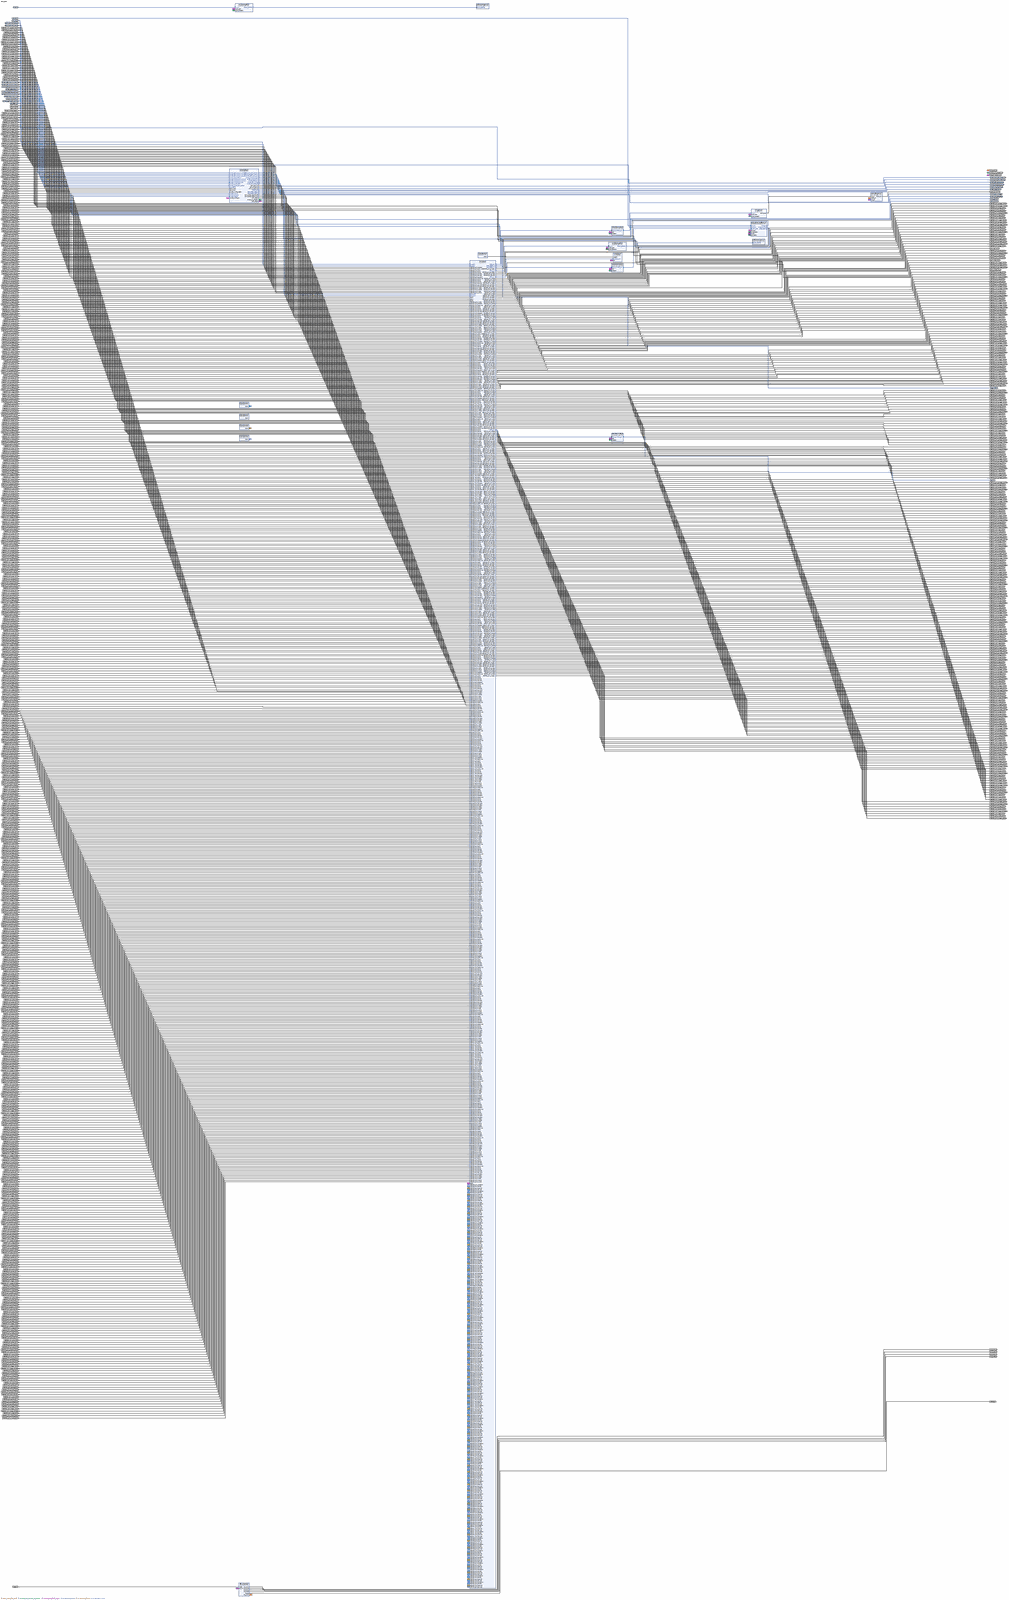
[diagram p0: block diagram of the top level, whole]
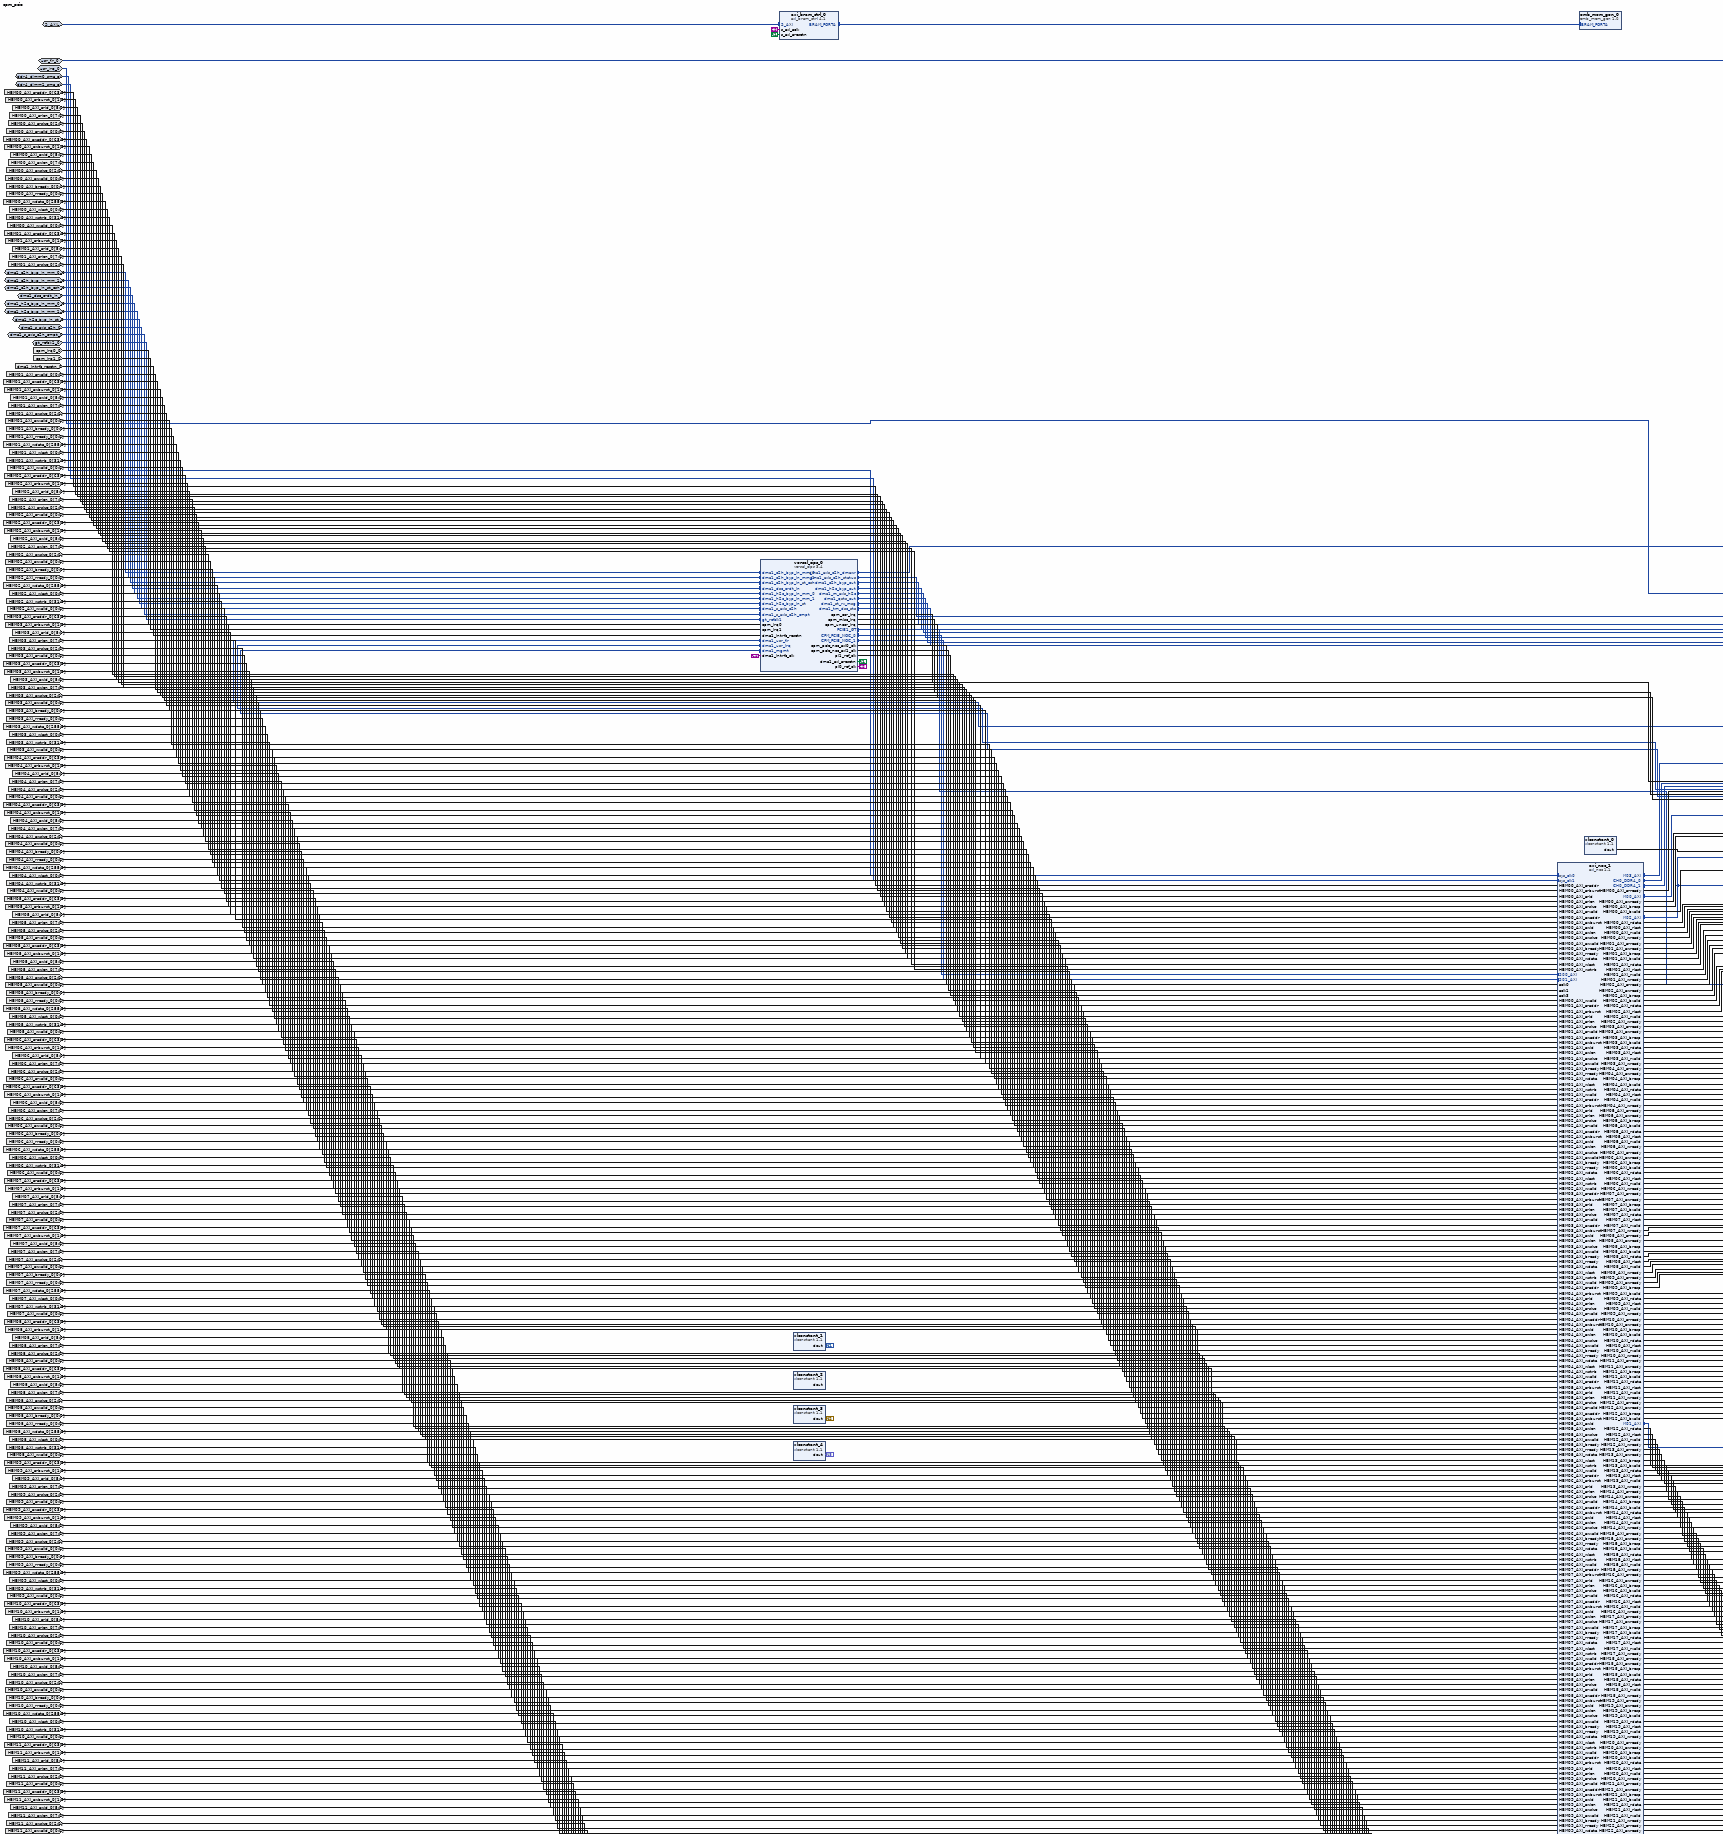
[diagram p1: block diagram of the top level, upper left part]
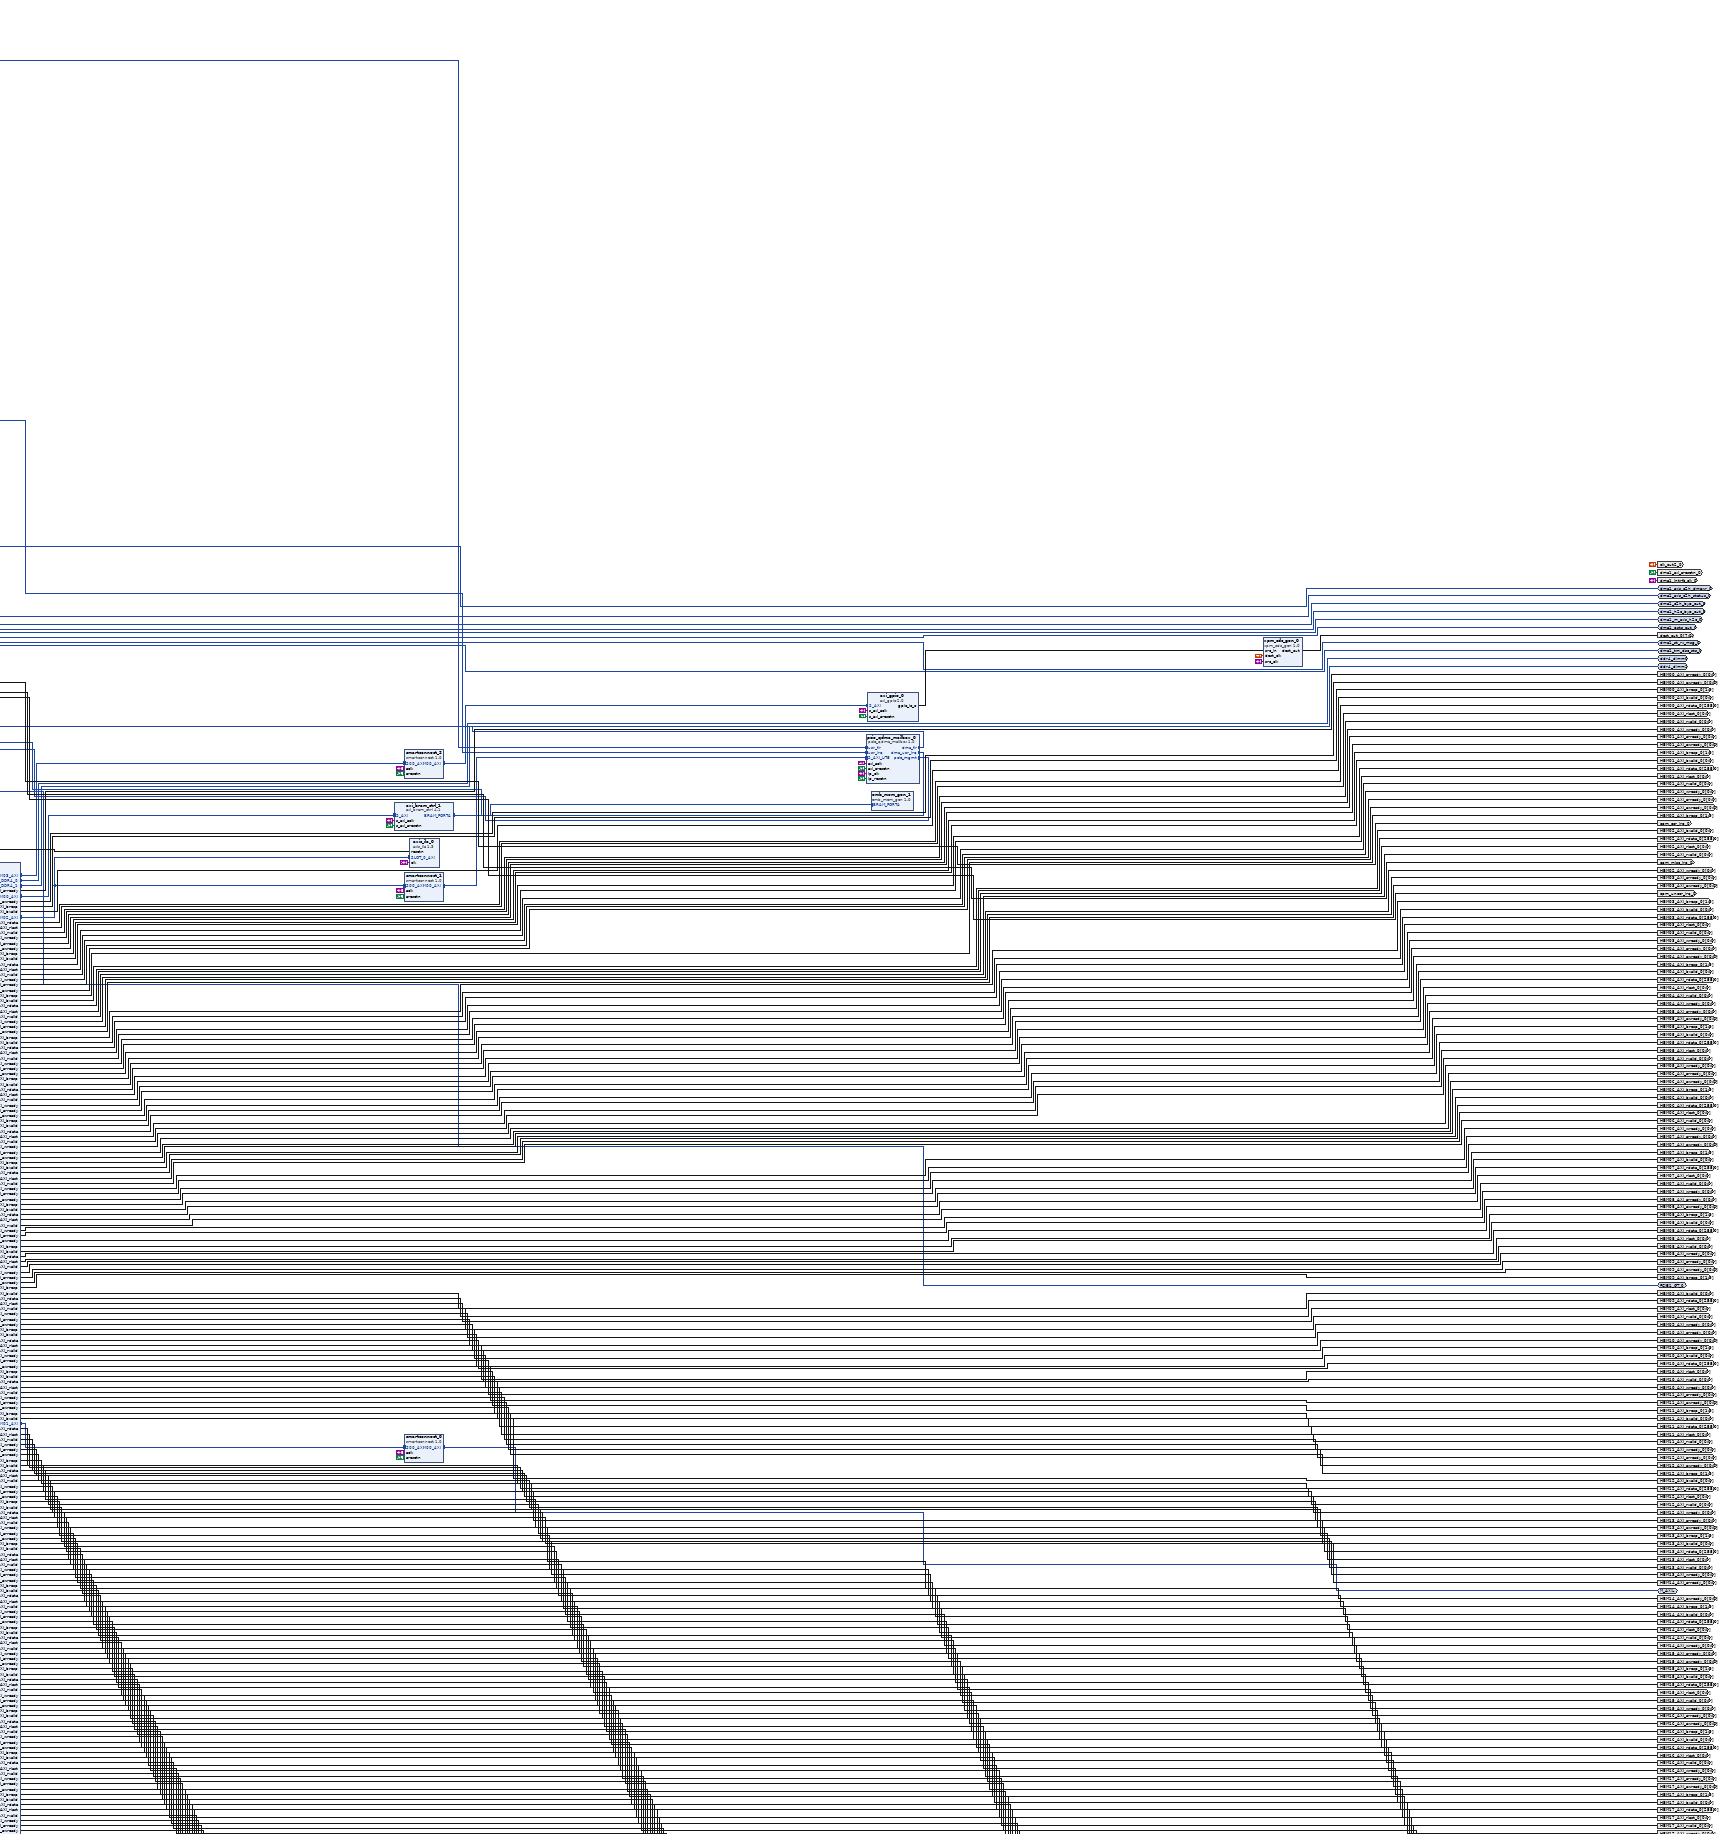
[diagram p2: block diagram of the top level, upper right part]
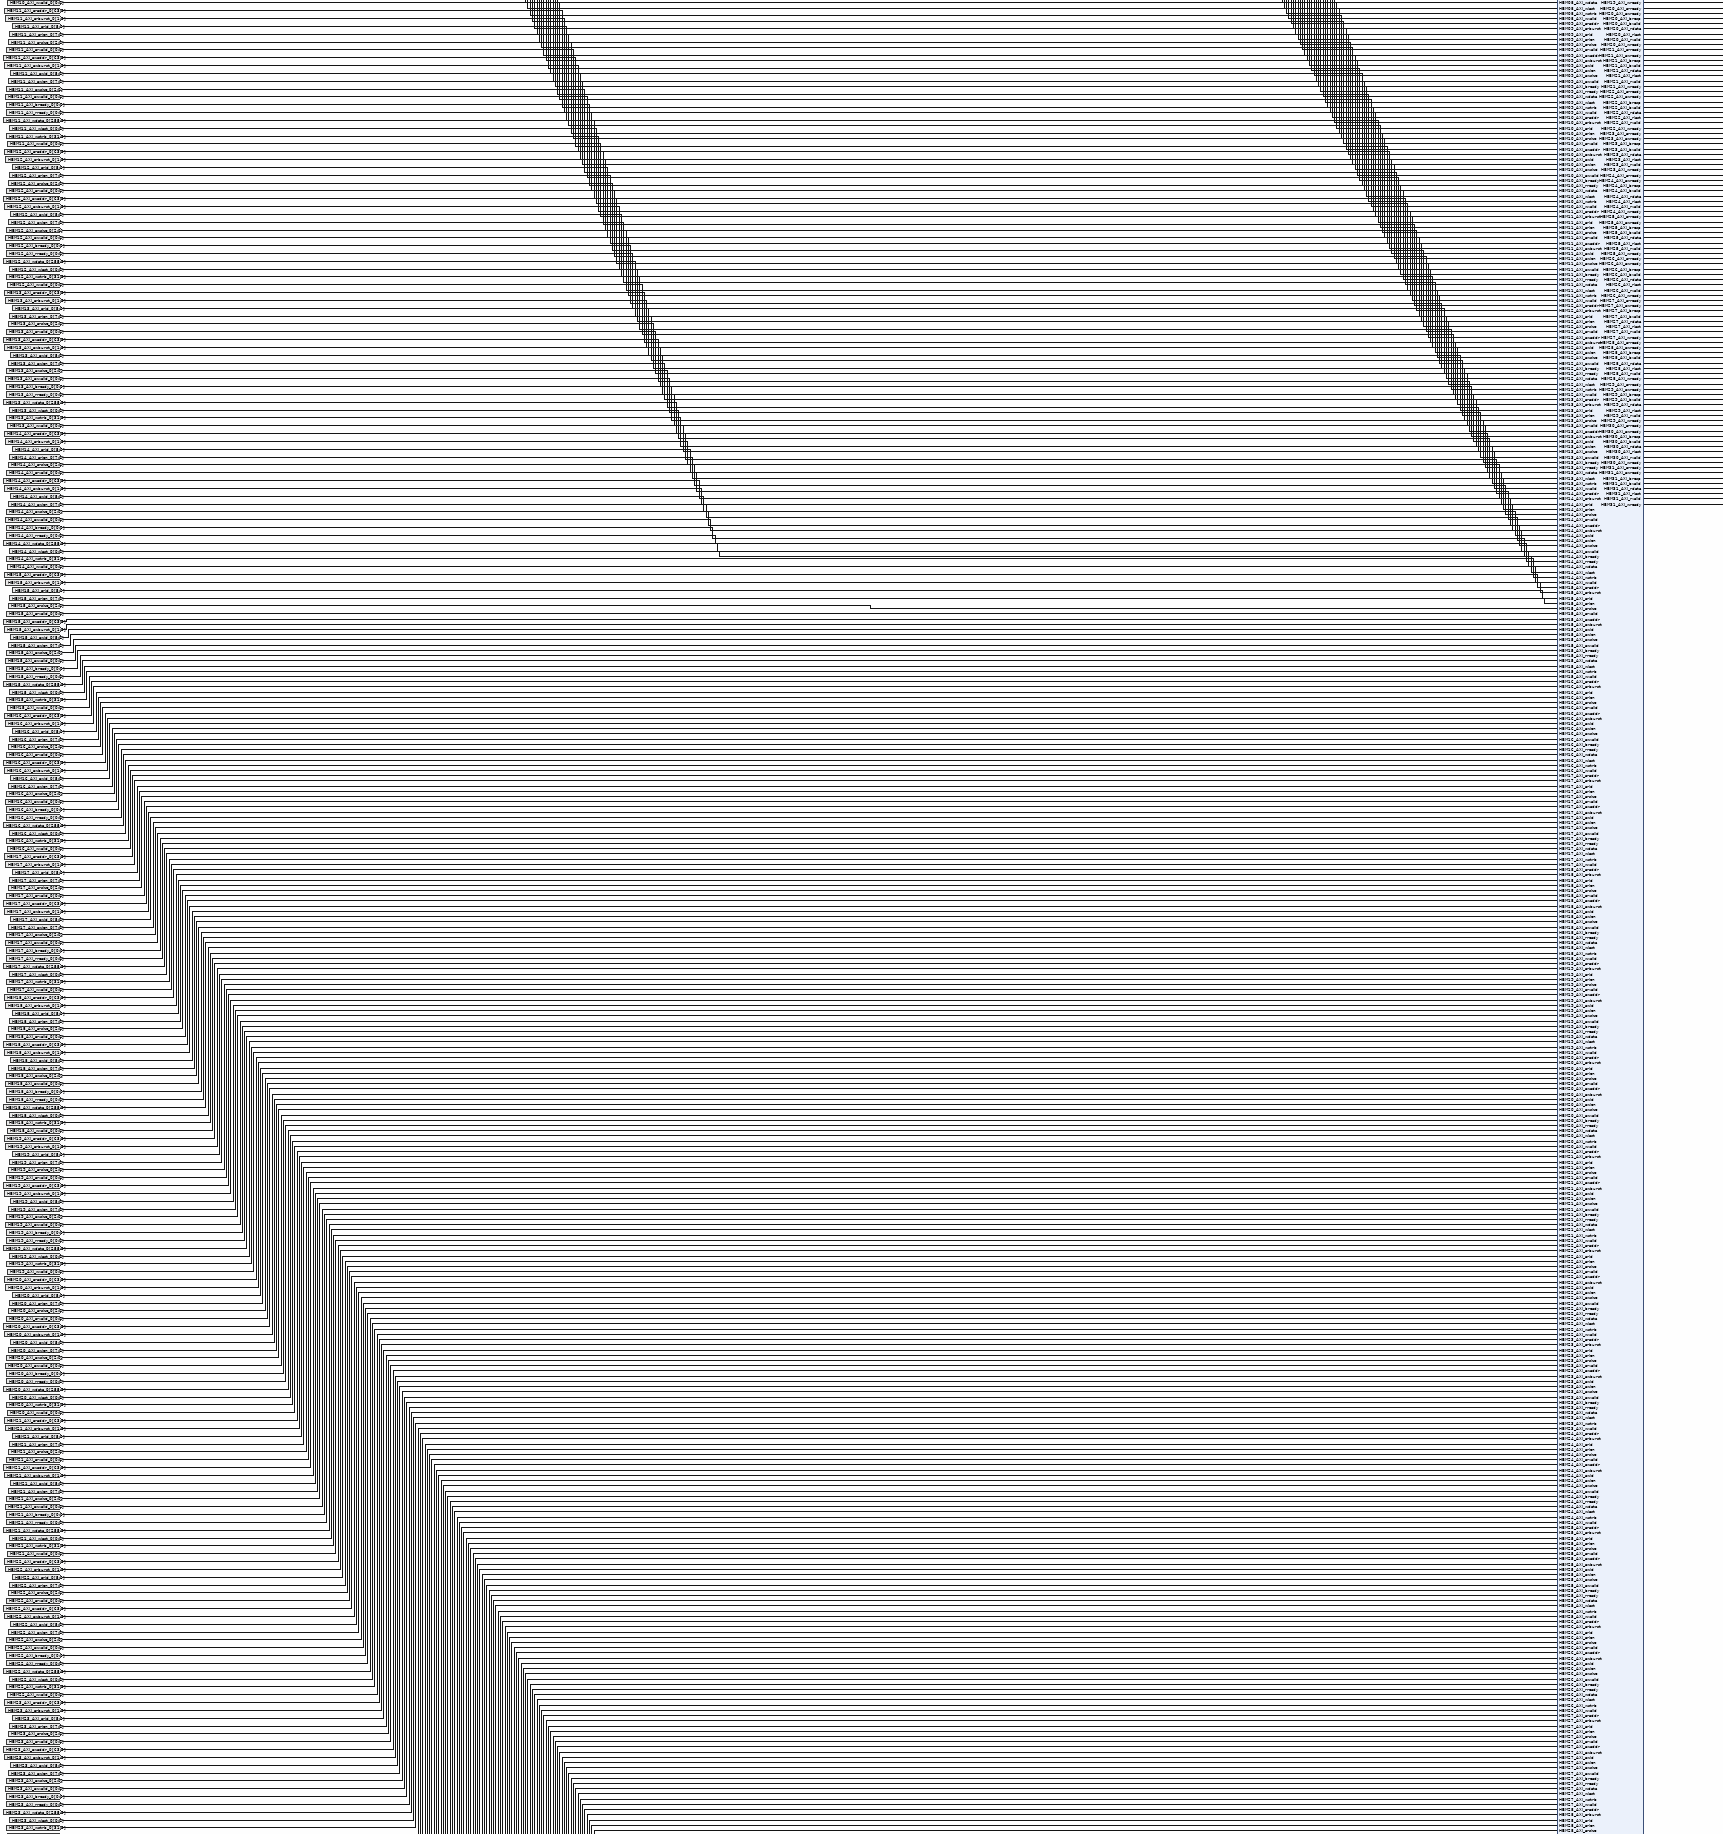
[diagram p3: block diagram of the top level, middle left part]
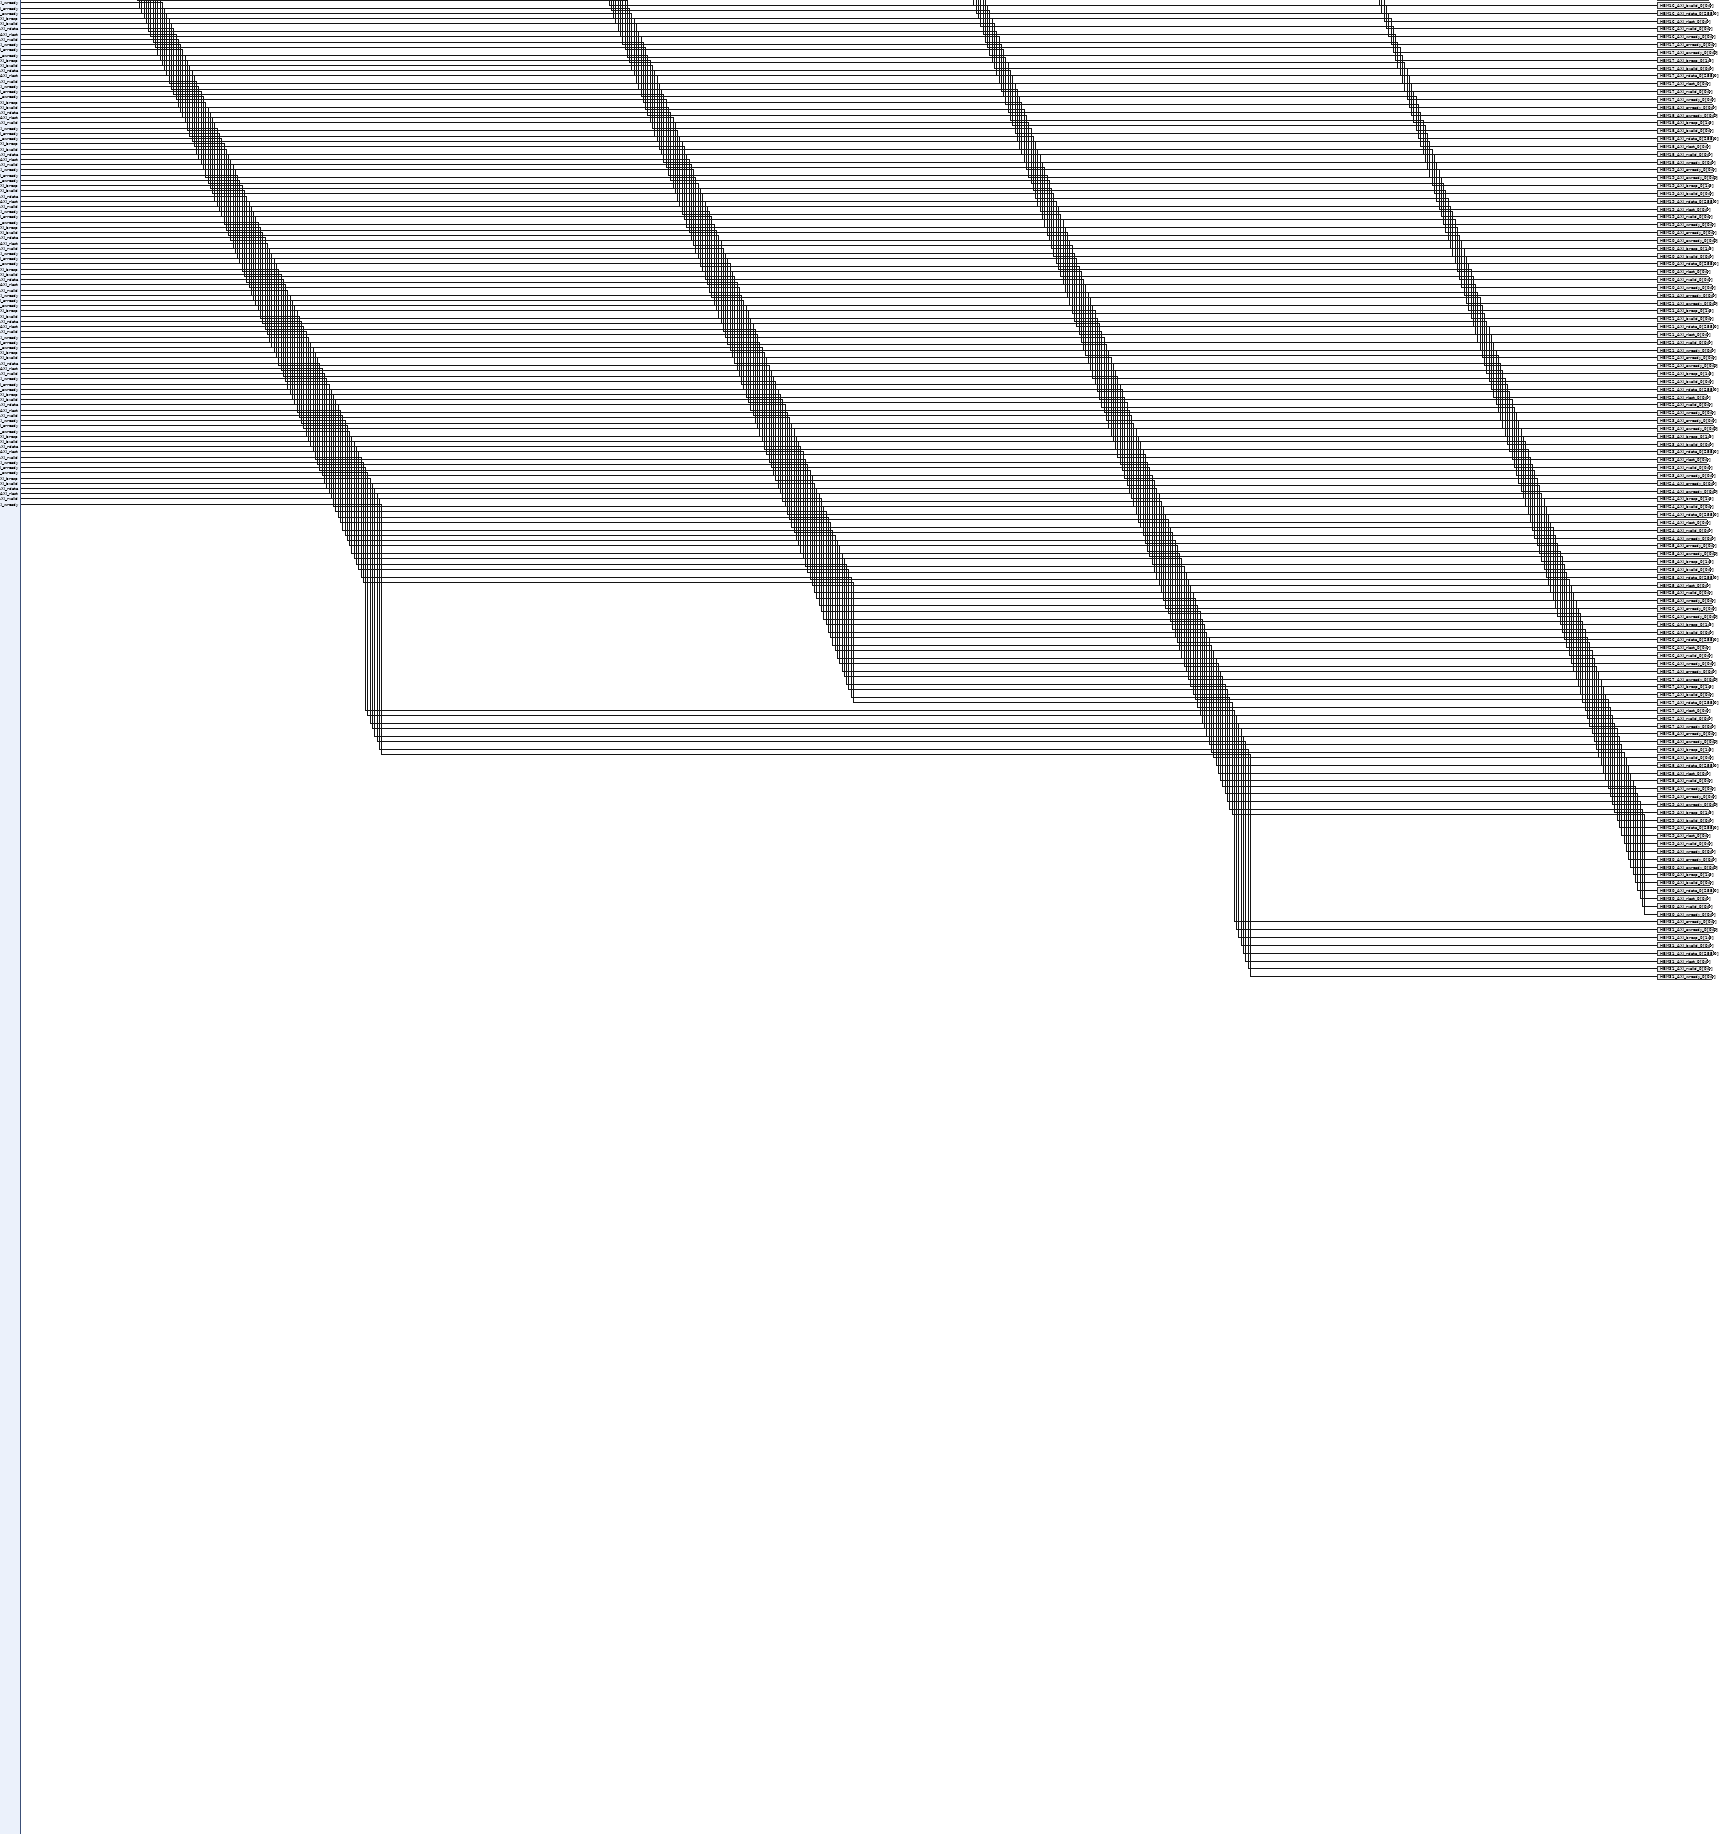
[diagram p4: block diagram of the top level, middle right part]
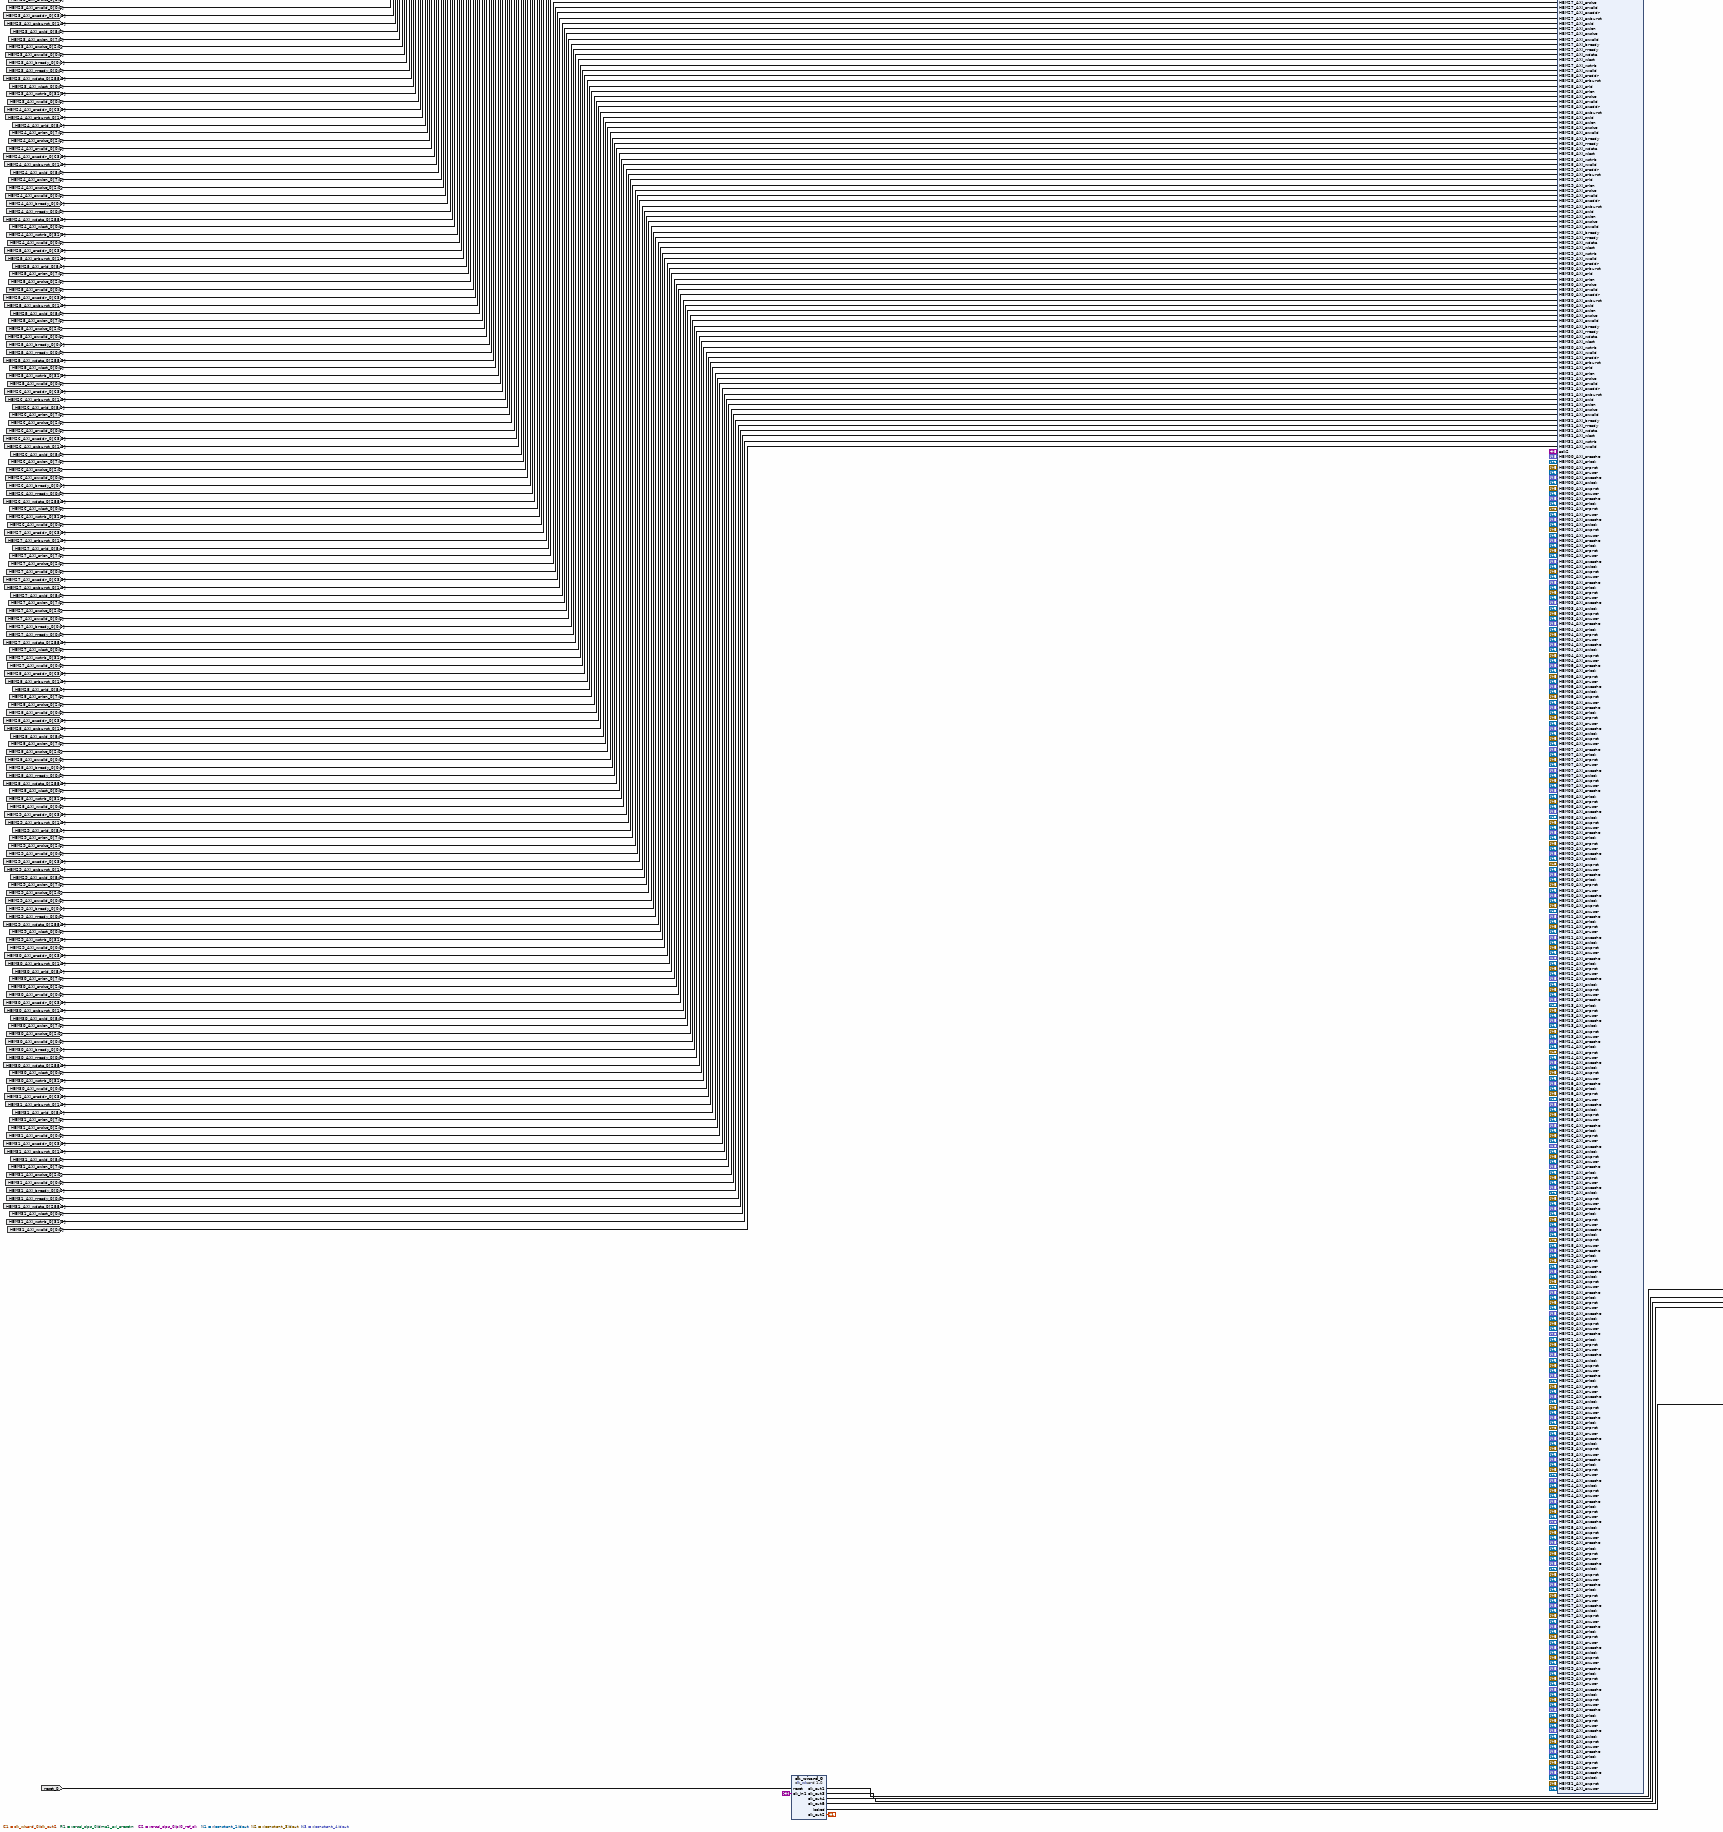
[diagram p5: block diagram of the top level, lower left part]
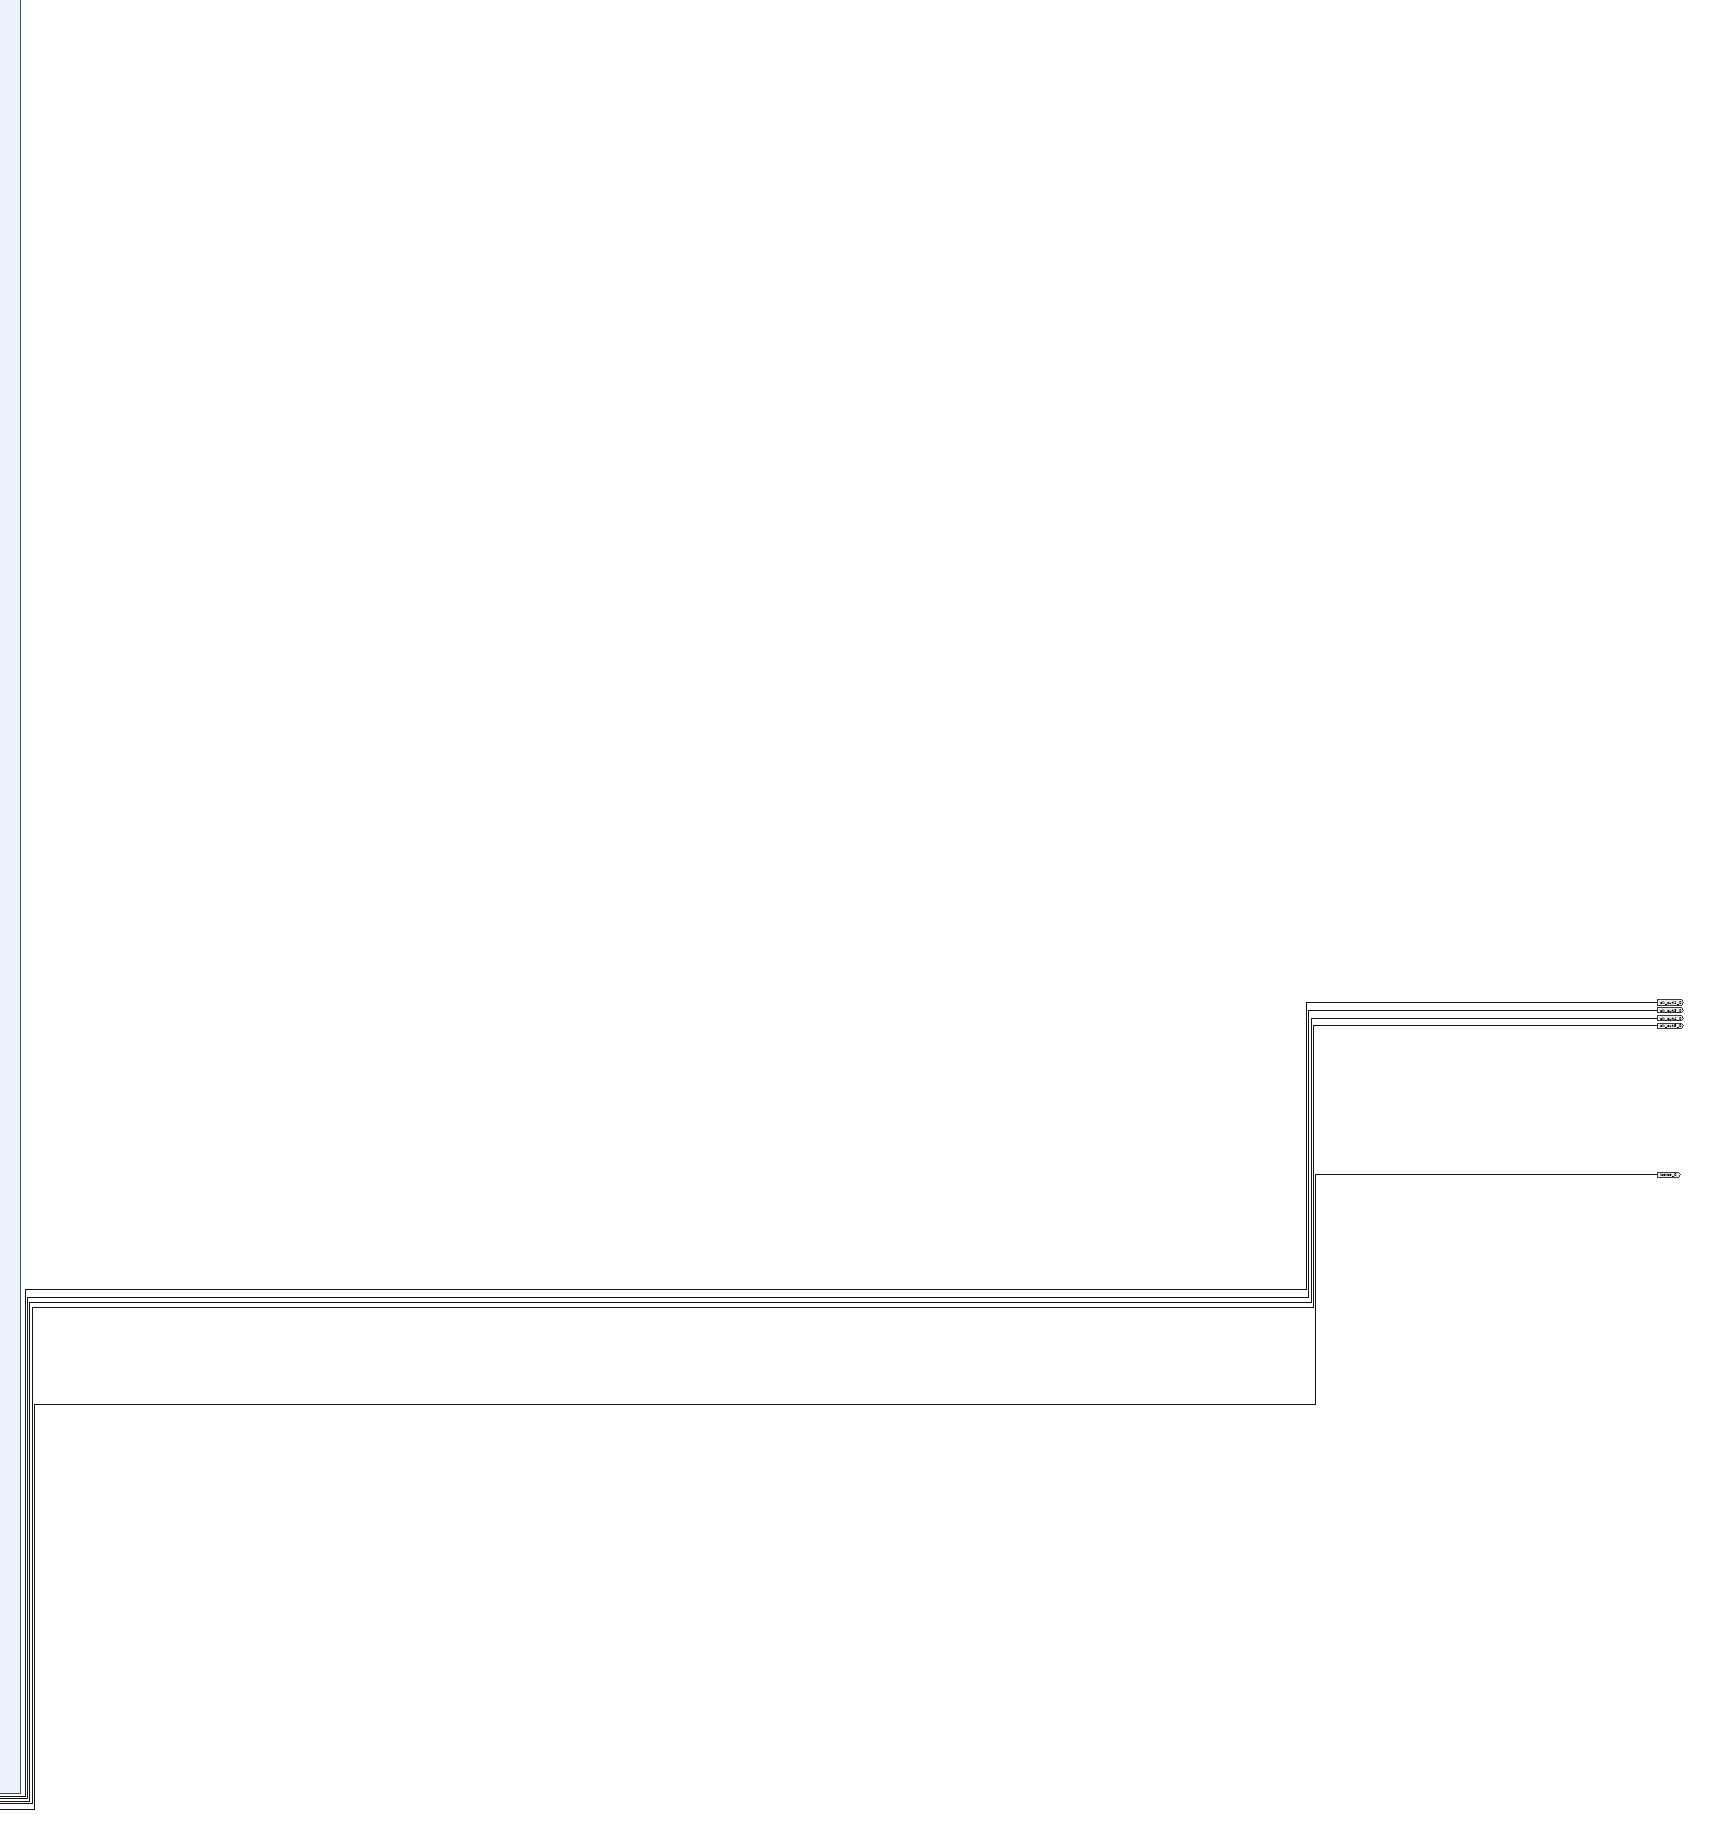
[diagram p6: block diagram of the top level, lower right part]
# Vivado block design cpm_pcie, xcvh1582-vsva3697-2MP-e-S, Vivado 2024.2
create_bd_design cpm_pcie

create_bd_intf_port -mode Slave -vlnv xilinx.com:display_eqdma:usr_flr_rtl:1.0 usr_flr_0
create_bd_intf_port -mode Slave -vlnv xilinx.com:interface:qdma_usr_irq_rtl:1.0 usr_irq_0
create_bd_intf_port -mode Slave -vlnv xilinx.com:interface:qdma_dsc_byp_rtl:1.0 dma1_c2h_byp_in_mm_0_0
create_bd_intf_port -mode Slave -vlnv xilinx.com:interface:qdma_dsc_byp_rtl:1.0 dma1_c2h_byp_in_mm_1_0
create_bd_intf_port -mode Slave -vlnv xilinx.com:interface:qdma_dsc_byp_rtl:1.0 dma1_h2c_byp_in_mm_0_0
create_bd_intf_port -mode Slave -vlnv xilinx.com:interface:qdma_dsc_byp_rtl:1.0 dma1_h2c_byp_in_mm_1_0
create_bd_intf_port -mode Slave -vlnv xilinx.com:interface:qdma_dsc_crdt_in_rtl:1.0 dma1_dsc_crdt_in_0
create_bd_intf_port -mode Slave -vlnv xilinx.com:interface:aximm_rtl:1.0 S_AXIL
set_property -dict [list \
  CONFIG.ADDR_WIDTH 15 \
  CONFIG.ARUSER_WIDTH 0 \
  CONFIG.AWUSER_WIDTH 0 \
  CONFIG.BUSER_WIDTH 0 \
  CONFIG.DATA_WIDTH 32 \
  CONFIG.HAS_BRESP 1 \
  CONFIG.HAS_BURST 0 \
  CONFIG.HAS_CACHE 0 \
  CONFIG.HAS_LOCK 0 \
  CONFIG.HAS_PROT 1 \
  CONFIG.HAS_QOS 0 \
  CONFIG.HAS_REGION 0 \
  CONFIG.HAS_RRESP 1 \
  CONFIG.HAS_WSTRB 1 \
  CONFIG.ID_WIDTH 0 \
  CONFIG.MAX_BURST_LENGTH 1 \
  CONFIG.NUM_READ_OUTSTANDING 1 \
  CONFIG.NUM_READ_THREADS 1 \
  CONFIG.NUM_WRITE_OUTSTANDING 1 \
  CONFIG.NUM_WRITE_THREADS 1 \
  CONFIG.PROTOCOL AXI4LITE \
  CONFIG.READ_WRITE_MODE READ_WRITE \
  CONFIG.RUSER_BITS_PER_BYTE 0 \
  CONFIG.RUSER_WIDTH 0 \
  CONFIG.SUPPORTS_NARROW_BURST 0 \
  CONFIG.WUSER_BITS_PER_BYTE 0 \
  CONFIG.WUSER_WIDTH 0 \
] [get_bd_intf_ports S_AXIL]
create_bd_intf_port -mode Master -vlnv xilinx.com:interface:aximm_rtl:1.0 M_AXIL
set_property -dict {CONFIG.ADDR_WIDTH 42 CONFIG.DATA_WIDTH 32 CONFIG.PROTOCOL AXI4} [get_bd_intf_ports M_AXIL]
create_bd_intf_port -mode Slave -vlnv xilinx.com:interface:diff_clock_rtl:1.0 gt_refclk1_0
create_bd_intf_port -mode Master -vlnv xilinx.com:interface:axis_rtl:1.0 dma1_st_rx_msg_0
create_bd_intf_port -mode Master -vlnv xilinx.com:interface:qdma_dsc_byp_rtl:1.0 dma1_c2h_byp_out_0
create_bd_intf_port -mode Master -vlnv xilinx.com:interface:qdma_dsc_byp_rtl:1.0 dma1_h2c_byp_out_0
create_bd_intf_port -mode Master -vlnv xilinx.com:interface:eqdma_qsts_rtl:1.0 dma1_qsts_out_0
create_bd_intf_port -mode Master -vlnv xilinx.com:interface:qdma_tm_dsc_sts_rtl:1.0 dma1_tm_dsc_sts_0
create_bd_intf_port -mode Master -vlnv xilinx.com:interface:gt_rtl:1.0 PCIE1_GT_0
create_bd_intf_port -mode Slave -vlnv xilinx.com:interface:qdma_dsc_byp_rtl:1.0 dma1_c2h_byp_in_st_csh_0
create_bd_intf_port -mode Slave -vlnv xilinx.com:interface:qdma_dsc_byp_rtl:1.0 dma1_h2c_byp_in_st_0
create_bd_intf_port -mode Slave -vlnv xilinx.com:display_eqdma:s_axis_c2h_rtl:1.0 dma1_s_axis_c2h_0
create_bd_intf_port -mode Slave -vlnv xilinx.com:display_eqdma:s_axis_c2h_cmpt_rtl:1.0 dma1_s_axis_c2h_cmpt_0
create_bd_intf_port -mode Master -vlnv xilinx.com:display_eqdma:axis_c2h_dmawr_rtl:1.0 dma1_axis_c2h_dmawr_0
create_bd_intf_port -mode Master -vlnv xilinx.com:display_eqdma:m_axis_h2c_rtl:1.0 dma1_m_axis_h2c_0
create_bd_intf_port -mode Master -vlnv xilinx.com:interface:qdma_c2h_status_rtl:1.0 dma1_axis_c2h_status_0
create_bd_intf_port -mode Master -vlnv xilinx.com:interface:ddr4_rtl:1.0 ddr4_dimm0
create_bd_intf_port -mode Master -vlnv xilinx.com:interface:ddr4_rtl:1.0 ddr4_dimm1
create_bd_intf_port -mode Slave -vlnv xilinx.com:interface:diff_clock_rtl:1.0 ddr4_dimm0_sma_clk
set_property -dict {CONFIG.FREQ_HZ 200000000} [get_bd_intf_ports ddr4_dimm0_sma_clk]
create_bd_intf_port -mode Slave -vlnv xilinx.com:interface:diff_clock_rtl:1.0 ddr4_dimm1_sma_clk
set_property -dict {CONFIG.FREQ_HZ 200000000} [get_bd_intf_ports ddr4_dimm1_sma_clk]
create_bd_port -dir I -type intr cpm_irq0_0
create_bd_port -dir I -type intr cpm_irq1_0
create_bd_port -dir I -type rst dma1_intrfc_resetn_0
create_bd_port -dir O -type intr cpm_misc_irq_0
create_bd_port -dir O -type intr cpm_cor_irq_0
create_bd_port -dir O -type intr cpm_uncor_irq_0
create_bd_port -dir O -type clk dma1_intrfc_clk_0
set_property -dict {CONFIG.ASSOCIATED_BUSIF S_AXIL:dma1_st_rx_msg_0:M_AXIL} [get_bd_ports dma1_intrfc_clk_0]
create_bd_port -dir O -type rst dma1_axi_aresetn_0
create_bd_port -dir O -from 7 -to 0 dest_out_0
create_bd_port -dir I -type rst reset_0
set_property -dict {CONFIG.POLARITY ACTIVE_HIGH} [get_bd_ports reset_0]
create_bd_port -dir O -type clk clk_out1_0
create_bd_port -dir O locked_0
create_bd_port -dir O -type clk clk_out4_0
create_bd_port -dir O -type clk clk_out3_0
create_bd_port -dir O -type clk clk_out2_0
create_bd_port -dir O -type clk clk_out5_0
create_bd_port -dir O -from 255 -to 0 HBM00_AXI_rdata_0
create_bd_port -dir I -from 255 -to 0 HBM00_AXI_wdata_0
create_bd_port -dir O -from 255 -to 0 HBM01_AXI_rdata_0
create_bd_port -dir I -from 255 -to 0 HBM01_AXI_wdata_0
create_bd_port -dir O -from 255 -to 0 HBM02_AXI_rdata_0
create_bd_port -dir I -from 255 -to 0 HBM02_AXI_wdata_0
create_bd_port -dir O -from 255 -to 0 HBM03_AXI_rdata_0
create_bd_port -dir I -from 255 -to 0 HBM03_AXI_wdata_0
create_bd_port -dir O -from 255 -to 0 HBM04_AXI_rdata_0
create_bd_port -dir I -from 255 -to 0 HBM04_AXI_wdata_0
create_bd_port -dir O -from 255 -to 0 HBM05_AXI_rdata_0
create_bd_port -dir I -from 255 -to 0 HBM05_AXI_wdata_0
create_bd_port -dir O -from 255 -to 0 HBM06_AXI_rdata_0
create_bd_port -dir I -from 255 -to 0 HBM06_AXI_wdata_0
create_bd_port -dir O -from 255 -to 0 HBM07_AXI_rdata_0
create_bd_port -dir I -from 255 -to 0 HBM07_AXI_wdata_0
create_bd_port -dir O -from 255 -to 0 HBM08_AXI_rdata_0
create_bd_port -dir I -from 255 -to 0 HBM08_AXI_wdata_0
create_bd_port -dir O -from 255 -to 0 HBM09_AXI_rdata_0
create_bd_port -dir I -from 255 -to 0 HBM09_AXI_wdata_0
create_bd_port -dir O -from 255 -to 0 HBM10_AXI_rdata_0
create_bd_port -dir I -from 255 -to 0 HBM10_AXI_wdata_0
create_bd_port -dir O -from 255 -to 0 HBM11_AXI_rdata_0
create_bd_port -dir I -from 255 -to 0 HBM11_AXI_wdata_0
create_bd_port -dir O -from 255 -to 0 HBM12_AXI_rdata_0
create_bd_port -dir I -from 255 -to 0 HBM12_AXI_wdata_0
create_bd_port -dir O -from 255 -to 0 HBM13_AXI_rdata_0
create_bd_port -dir I -from 255 -to 0 HBM13_AXI_wdata_0
create_bd_port -dir O -from 255 -to 0 HBM14_AXI_rdata_0
create_bd_port -dir I -from 255 -to 0 HBM14_AXI_wdata_0
create_bd_port -dir O -from 255 -to 0 HBM15_AXI_rdata_0
create_bd_port -dir I -from 255 -to 0 HBM15_AXI_wdata_0
create_bd_port -dir O -from 255 -to 0 HBM16_AXI_rdata_0
create_bd_port -dir I -from 255 -to 0 HBM16_AXI_wdata_0
create_bd_port -dir O -from 255 -to 0 HBM17_AXI_rdata_0
create_bd_port -dir I -from 255 -to 0 HBM17_AXI_wdata_0
create_bd_port -dir O -from 255 -to 0 HBM18_AXI_rdata_0
create_bd_port -dir I -from 255 -to 0 HBM18_AXI_wdata_0
create_bd_port -dir O -from 255 -to 0 HBM19_AXI_rdata_0
create_bd_port -dir I -from 255 -to 0 HBM19_AXI_wdata_0
create_bd_port -dir O -from 255 -to 0 HBM20_AXI_rdata_0
create_bd_port -dir I -from 255 -to 0 HBM20_AXI_wdata_0
create_bd_port -dir O -from 255 -to 0 HBM21_AXI_rdata_0
create_bd_port -dir I -from 255 -to 0 HBM21_AXI_wdata_0
create_bd_port -dir O -from 255 -to 0 HBM22_AXI_rdata_0
create_bd_port -dir I -from 255 -to 0 HBM22_AXI_wdata_0
create_bd_port -dir O -from 255 -to 0 HBM23_AXI_rdata_0
create_bd_port -dir I -from 255 -to 0 HBM23_AXI_wdata_0
create_bd_port -dir O -from 255 -to 0 HBM24_AXI_rdata_0
create_bd_port -dir I -from 255 -to 0 HBM24_AXI_wdata_0
create_bd_port -dir O -from 255 -to 0 HBM25_AXI_rdata_0
create_bd_port -dir I -from 255 -to 0 HBM25_AXI_wdata_0
create_bd_port -dir O -from 255 -to 0 HBM26_AXI_rdata_0
create_bd_port -dir I -from 255 -to 0 HBM26_AXI_wdata_0
create_bd_port -dir O -from 255 -to 0 HBM27_AXI_rdata_0
create_bd_port -dir I -from 255 -to 0 HBM27_AXI_wdata_0
create_bd_port -dir O -from 255 -to 0 HBM28_AXI_rdata_0
create_bd_port -dir I -from 255 -to 0 HBM28_AXI_wdata_0
create_bd_port -dir O -from 255 -to 0 HBM29_AXI_rdata_0
create_bd_port -dir I -from 255 -to 0 HBM29_AXI_wdata_0
create_bd_port -dir O -from 255 -to 0 HBM30_AXI_rdata_0
create_bd_port -dir I -from 255 -to 0 HBM30_AXI_wdata_0
create_bd_port -dir O -from 255 -to 0 HBM31_AXI_rdata_0
create_bd_port -dir I -from 255 -to 0 HBM31_AXI_wdata_0
create_bd_port -dir I -from 0 -to 0 HBM00_AXI_awvalid_0
create_bd_port -dir O -from 0 -to 0 HBM00_AXI_wready_0
create_bd_port -dir O -from 0 -to 0 HBM00_AXI_rvalid_0
create_bd_port -dir O -from 1 -to 0 HBM00_AXI_bresp_0
create_bd_port -dir I -from 1 -to 0 HBM00_AXI_awburst_0
create_bd_port -dir I -from 2 -to 0 HBM00_AXI_awsize_0
create_bd_port -dir O -from 0 -to 0 HBM00_AXI_rlast_0
create_bd_port -dir I -from 0 -to 0 HBM00_AXI_arvalid_0
create_bd_port -dir I -from 0 -to 0 HBM00_AXI_wlast_0
create_bd_port -dir I -from 2 -to 0 HBM00_AXI_arsize_0
create_bd_port -dir I -from 0 -to 0 HBM00_AXI_bready_0
create_bd_port -dir I -from 0 -to 0 HBM00_AXI_wvalid_0
create_bd_port -dir O -from 0 -to 0 HBM00_AXI_arready_0
create_bd_port -dir O -from 0 -to 0 HBM00_AXI_bvalid_0
create_bd_port -dir O -from 0 -to 0 HBM00_AXI_awready_0
create_bd_port -dir I -from 1 -to 0 HBM00_AXI_arburst_0
create_bd_port -dir I -from 0 -to 0 HBM00_AXI_rready_0
create_bd_port -dir I -from 1 -to 0 HBM01_AXI_awburst_0
create_bd_port -dir I -from 2 -to 0 HBM01_AXI_awsize_0
create_bd_port -dir I -from 0 -to 0 HBM01_AXI_wlast_0
create_bd_port -dir O -from 1 -to 0 HBM01_AXI_bresp_0
create_bd_port -dir O -from 0 -to 0 HBM01_AXI_awready_0
create_bd_port -dir I -from 0 -to 0 HBM01_AXI_bready_0
create_bd_port -dir I -from 0 -to 0 HBM01_AXI_awvalid_0
create_bd_port -dir O -from 0 -to 0 HBM01_AXI_bvalid_0
create_bd_port -dir I -from 0 -to 0 HBM01_AXI_arvalid_0
create_bd_port -dir I -from 0 -to 0 HBM01_AXI_wvalid_0
create_bd_port -dir O -from 0 -to 0 HBM01_AXI_rlast_0
create_bd_port -dir O -from 0 -to 0 HBM01_AXI_rvalid_0
create_bd_port -dir I -from 1 -to 0 HBM01_AXI_arburst_0
create_bd_port -dir O -from 0 -to 0 HBM01_AXI_wready_0
create_bd_port -dir I -from 2 -to 0 HBM01_AXI_arsize_0
create_bd_port -dir O -from 0 -to 0 HBM01_AXI_arready_0
create_bd_port -dir I -from 0 -to 0 HBM01_AXI_rready_0
create_bd_port -dir O -from 0 -to 0 HBM02_AXI_wready_0
create_bd_port -dir I -from 2 -to 0 HBM02_AXI_arsize_0
create_bd_port -dir I -from 1 -to 0 HBM02_AXI_awburst_0
create_bd_port -dir O -from 1 -to 0 HBM02_AXI_bresp_0
create_bd_port -dir I -from 0 -to 0 HBM02_AXI_wlast_0
create_bd_port -dir I -from 2 -to 0 HBM02_AXI_awsize_0
create_bd_port -dir I -from 1 -to 0 HBM02_AXI_arburst_0
create_bd_port -dir O -from 0 -to 0 HBM02_AXI_awready_0
create_bd_port -dir I -from 0 -to 0 HBM02_AXI_awvalid_0
create_bd_port -dir I -from 0 -to 0 HBM02_AXI_wvalid_0
create_bd_port -dir I -from 0 -to 0 HBM02_AXI_bready_0
create_bd_port -dir O -from 0 -to 0 HBM02_AXI_rlast_0
create_bd_port -dir O -from 0 -to 0 HBM02_AXI_bvalid_0
create_bd_port -dir I -from 0 -to 0 HBM02_AXI_arvalid_0
create_bd_port -dir O -from 0 -to 0 HBM02_AXI_rvalid_0
create_bd_port -dir O -from 0 -to 0 HBM02_AXI_arready_0
create_bd_port -dir I -from 0 -to 0 HBM02_AXI_rready_0
create_bd_port -dir O -from 0 -to 0 HBM03_AXI_rvalid_0
create_bd_port -dir I -from 2 -to 0 HBM03_AXI_awsize_0
create_bd_port -dir O -from 0 -to 0 HBM03_AXI_awready_0
create_bd_port -dir I -from 0 -to 0 HBM03_AXI_awvalid_0
create_bd_port -dir I -from 2 -to 0 HBM03_AXI_arsize_0
create_bd_port -dir O -from 1 -to 0 HBM03_AXI_bresp_0
create_bd_port -dir O -from 0 -to 0 HBM03_AXI_arready_0
create_bd_port -dir I -from 0 -to 0 HBM03_AXI_bready_0
create_bd_port -dir O -from 0 -to 0 HBM03_AXI_bvalid_0
create_bd_port -dir I -from 0 -to 0 HBM03_AXI_wvalid_0
create_bd_port -dir I -from 1 -to 0 HBM03_AXI_arburst_0
create_bd_port -dir O -from 0 -to 0 HBM03_AXI_wready_0
create_bd_port -dir I -from 0 -to 0 HBM03_AXI_wlast_0
create_bd_port -dir I -from 0 -to 0 HBM03_AXI_arvalid_0
create_bd_port -dir O -from 0 -to 0 HBM03_AXI_rlast_0
create_bd_port -dir I -from 1 -to 0 HBM03_AXI_awburst_0
create_bd_port -dir I -from 0 -to 0 HBM03_AXI_rready_0
create_bd_port -dir I -from 63 -to 0 HBM00_AXI_araddr_0
create_bd_port -dir I -from 5 -to 0 HBM00_AXI_arid_0
create_bd_port -dir I -from 7 -to 0 HBM00_AXI_arlen_0
create_bd_port -dir I -from 63 -to 0 HBM00_AXI_awaddr_0
create_bd_port -dir I -from 5 -to 0 HBM00_AXI_awid_0
create_bd_port -dir I -from 7 -to 0 HBM00_AXI_awlen_0
create_bd_port -dir I -from 31 -to 0 HBM00_AXI_wstrb_0
create_bd_port -dir I -from 63 -to 0 HBM01_AXI_araddr_0
create_bd_port -dir I -from 5 -to 0 HBM01_AXI_arid_0
create_bd_port -dir I -from 7 -to 0 HBM01_AXI_arlen_0
create_bd_port -dir I -from 63 -to 0 HBM01_AXI_awaddr_0
create_bd_port -dir I -from 5 -to 0 HBM01_AXI_awid_0
create_bd_port -dir I -from 7 -to 0 HBM01_AXI_awlen_0
create_bd_port -dir I -from 31 -to 0 HBM01_AXI_wstrb_0
create_bd_port -dir I -from 63 -to 0 HBM02_AXI_araddr_0
create_bd_port -dir I -from 5 -to 0 HBM02_AXI_arid_0
create_bd_port -dir I -from 7 -to 0 HBM02_AXI_arlen_0
create_bd_port -dir I -from 63 -to 0 HBM02_AXI_awaddr_0
create_bd_port -dir I -from 5 -to 0 HBM02_AXI_awid_0
create_bd_port -dir I -from 7 -to 0 HBM02_AXI_awlen_0
create_bd_port -dir I -from 31 -to 0 HBM02_AXI_wstrb_0
create_bd_port -dir I -from 63 -to 0 HBM03_AXI_araddr_0
create_bd_port -dir I -from 5 -to 0 HBM03_AXI_arid_0
create_bd_port -dir I -from 7 -to 0 HBM03_AXI_arlen_0
create_bd_port -dir I -from 63 -to 0 HBM03_AXI_awaddr_0
create_bd_port -dir I -from 5 -to 0 HBM03_AXI_awid_0
create_bd_port -dir I -from 7 -to 0 HBM03_AXI_awlen_0
create_bd_port -dir I -from 31 -to 0 HBM03_AXI_wstrb_0
create_bd_port -dir I -from 63 -to 0 HBM04_AXI_araddr_0
create_bd_port -dir I -from 5 -to 0 HBM04_AXI_arid_0
create_bd_port -dir I -from 7 -to 0 HBM04_AXI_arlen_0
create_bd_port -dir I -from 63 -to 0 HBM04_AXI_awaddr_0
create_bd_port -dir I -from 5 -to 0 HBM04_AXI_awid_0
create_bd_port -dir I -from 7 -to 0 HBM04_AXI_awlen_0
create_bd_port -dir I -from 31 -to 0 HBM04_AXI_wstrb_0
create_bd_port -dir I -from 63 -to 0 HBM05_AXI_araddr_0
create_bd_port -dir I -from 5 -to 0 HBM05_AXI_arid_0
create_bd_port -dir I -from 7 -to 0 HBM05_AXI_arlen_0
create_bd_port -dir I -from 63 -to 0 HBM05_AXI_awaddr_0
create_bd_port -dir I -from 5 -to 0 HBM05_AXI_awid_0
create_bd_port -dir I -from 7 -to 0 HBM05_AXI_awlen_0
create_bd_port -dir I -from 31 -to 0 HBM05_AXI_wstrb_0
create_bd_port -dir I -from 63 -to 0 HBM06_AXI_araddr_0
create_bd_port -dir I -from 5 -to 0 HBM06_AXI_arid_0
create_bd_port -dir I -from 7 -to 0 HBM06_AXI_arlen_0
create_bd_port -dir I -from 63 -to 0 HBM06_AXI_awaddr_0
create_bd_port -dir I -from 5 -to 0 HBM06_AXI_awid_0
create_bd_port -dir I -from 7 -to 0 HBM06_AXI_awlen_0
create_bd_port -dir I -from 31 -to 0 HBM06_AXI_wstrb_0
create_bd_port -dir I -from 63 -to 0 HBM07_AXI_araddr_0
create_bd_port -dir I -from 5 -to 0 HBM07_AXI_arid_0
create_bd_port -dir I -from 7 -to 0 HBM07_AXI_arlen_0
create_bd_port -dir I -from 63 -to 0 HBM07_AXI_awaddr_0
create_bd_port -dir I -from 5 -to 0 HBM07_AXI_awid_0
create_bd_port -dir I -from 7 -to 0 HBM07_AXI_awlen_0
create_bd_port -dir I -from 31 -to 0 HBM07_AXI_wstrb_0
create_bd_port -dir I -from 63 -to 0 HBM08_AXI_araddr_0
create_bd_port -dir I -from 5 -to 0 HBM08_AXI_arid_0
create_bd_port -dir I -from 7 -to 0 HBM08_AXI_arlen_0
create_bd_port -dir I -from 63 -to 0 HBM08_AXI_awaddr_0
create_bd_port -dir I -from 5 -to 0 HBM08_AXI_awid_0
create_bd_port -dir I -from 7 -to 0 HBM08_AXI_awlen_0
create_bd_port -dir I -from 31 -to 0 HBM08_AXI_wstrb_0
create_bd_port -dir I -from 63 -to 0 HBM09_AXI_araddr_0
create_bd_port -dir I -from 5 -to 0 HBM09_AXI_arid_0
create_bd_port -dir I -from 7 -to 0 HBM09_AXI_arlen_0
create_bd_port -dir I -from 63 -to 0 HBM09_AXI_awaddr_0
create_bd_port -dir I -from 5 -to 0 HBM09_AXI_awid_0
create_bd_port -dir I -from 7 -to 0 HBM09_AXI_awlen_0
create_bd_port -dir I -from 31 -to 0 HBM09_AXI_wstrb_0
create_bd_port -dir I -from 63 -to 0 HBM10_AXI_araddr_0
create_bd_port -dir I -from 5 -to 0 HBM10_AXI_arid_0
create_bd_port -dir I -from 7 -to 0 HBM10_AXI_arlen_0
create_bd_port -dir I -from 63 -to 0 HBM10_AXI_awaddr_0
create_bd_port -dir I -from 5 -to 0 HBM10_AXI_awid_0
create_bd_port -dir I -from 7 -to 0 HBM10_AXI_awlen_0
create_bd_port -dir I -from 31 -to 0 HBM10_AXI_wstrb_0
create_bd_port -dir I -from 63 -to 0 HBM11_AXI_araddr_0
create_bd_port -dir I -from 5 -to 0 HBM11_AXI_arid_0
create_bd_port -dir I -from 7 -to 0 HBM11_AXI_arlen_0
create_bd_port -dir I -from 63 -to 0 HBM11_AXI_awaddr_0
create_bd_port -dir I -from 5 -to 0 HBM11_AXI_awid_0
create_bd_port -dir I -from 7 -to 0 HBM11_AXI_awlen_0
create_bd_port -dir I -from 31 -to 0 HBM11_AXI_wstrb_0
create_bd_port -dir I -from 63 -to 0 HBM12_AXI_araddr_0
create_bd_port -dir I -from 5 -to 0 HBM12_AXI_arid_0
create_bd_port -dir I -from 7 -to 0 HBM12_AXI_arlen_0
create_bd_port -dir I -from 63 -to 0 HBM12_AXI_awaddr_0
create_bd_port -dir I -from 5 -to 0 HBM12_AXI_awid_0
create_bd_port -dir I -from 7 -to 0 HBM12_AXI_awlen_0
create_bd_port -dir I -from 31 -to 0 HBM12_AXI_wstrb_0
create_bd_port -dir I -from 63 -to 0 HBM13_AXI_araddr_0
create_bd_port -dir I -from 5 -to 0 HBM13_AXI_arid_0
create_bd_port -dir I -from 7 -to 0 HBM13_AXI_arlen_0
create_bd_port -dir I -from 63 -to 0 HBM13_AXI_awaddr_0
create_bd_port -dir I -from 5 -to 0 HBM13_AXI_awid_0
create_bd_port -dir I -from 7 -to 0 HBM13_AXI_awlen_0
create_bd_port -dir I -from 31 -to 0 HBM13_AXI_wstrb_0
create_bd_port -dir I -from 63 -to 0 HBM14_AXI_araddr_0
create_bd_port -dir I -from 5 -to 0 HBM14_AXI_arid_0
create_bd_port -dir I -from 7 -to 0 HBM14_AXI_arlen_0
create_bd_port -dir I -from 63 -to 0 HBM14_AXI_awaddr_0
create_bd_port -dir I -from 5 -to 0 HBM14_AXI_awid_0
create_bd_port -dir I -from 7 -to 0 HBM14_AXI_awlen_0
create_bd_port -dir I -from 31 -to 0 HBM14_AXI_wstrb_0
create_bd_port -dir I -from 63 -to 0 HBM15_AXI_araddr_0
create_bd_port -dir I -from 5 -to 0 HBM15_AXI_arid_0
create_bd_port -dir I -from 7 -to 0 HBM15_AXI_arlen_0
create_bd_port -dir I -from 63 -to 0 HBM15_AXI_awaddr_0
create_bd_port -dir I -from 5 -to 0 HBM15_AXI_awid_0
create_bd_port -dir I -from 7 -to 0 HBM15_AXI_awlen_0
create_bd_port -dir I -from 31 -to 0 HBM15_AXI_wstrb_0
create_bd_port -dir I -from 63 -to 0 HBM16_AXI_araddr_0
create_bd_port -dir I -from 5 -to 0 HBM16_AXI_arid_0
create_bd_port -dir I -from 7 -to 0 HBM16_AXI_arlen_0
create_bd_port -dir I -from 63 -to 0 HBM16_AXI_awaddr_0
create_bd_port -dir I -from 5 -to 0 HBM16_AXI_awid_0
create_bd_port -dir I -from 7 -to 0 HBM16_AXI_awlen_0
create_bd_port -dir I -from 31 -to 0 HBM16_AXI_wstrb_0
create_bd_port -dir I -from 63 -to 0 HBM17_AXI_araddr_0
create_bd_port -dir I -from 5 -to 0 HBM17_AXI_arid_0
create_bd_port -dir I -from 7 -to 0 HBM17_AXI_arlen_0
create_bd_port -dir I -from 63 -to 0 HBM17_AXI_awaddr_0
create_bd_port -dir I -from 5 -to 0 HBM17_AXI_awid_0
create_bd_port -dir I -from 7 -to 0 HBM17_AXI_awlen_0
create_bd_port -dir I -from 31 -to 0 HBM17_AXI_wstrb_0
create_bd_port -dir I -from 63 -to 0 HBM18_AXI_araddr_0
create_bd_port -dir I -from 5 -to 0 HBM18_AXI_arid_0
create_bd_port -dir I -from 7 -to 0 HBM18_AXI_arlen_0
create_bd_port -dir I -from 63 -to 0 HBM18_AXI_awaddr_0
create_bd_port -dir I -from 5 -to 0 HBM18_AXI_awid_0
create_bd_port -dir I -from 7 -to 0 HBM18_AXI_awlen_0
create_bd_port -dir I -from 31 -to 0 HBM18_AXI_wstrb_0
create_bd_port -dir I -from 63 -to 0 HBM19_AXI_araddr_0
create_bd_port -dir I -from 5 -to 0 HBM19_AXI_arid_0
create_bd_port -dir I -from 7 -to 0 HBM19_AXI_arlen_0
create_bd_port -dir I -from 63 -to 0 HBM19_AXI_awaddr_0
create_bd_port -dir I -from 5 -to 0 HBM19_AXI_awid_0
create_bd_port -dir I -from 7 -to 0 HBM19_AXI_awlen_0
create_bd_port -dir I -from 31 -to 0 HBM19_AXI_wstrb_0
create_bd_port -dir I -from 63 -to 0 HBM20_AXI_araddr_0
create_bd_port -dir I -from 5 -to 0 HBM20_AXI_arid_0
create_bd_port -dir I -from 7 -to 0 HBM20_AXI_arlen_0
create_bd_port -dir I -from 63 -to 0 HBM20_AXI_awaddr_0
create_bd_port -dir I -from 5 -to 0 HBM20_AXI_awid_0
create_bd_port -dir I -from 7 -to 0 HBM20_AXI_awlen_0
create_bd_port -dir I -from 31 -to 0 HBM20_AXI_wstrb_0
create_bd_port -dir I -from 63 -to 0 HBM21_AXI_araddr_0
create_bd_port -dir I -from 5 -to 0 HBM21_AXI_arid_0
create_bd_port -dir I -from 7 -to 0 HBM21_AXI_arlen_0
create_bd_port -dir I -from 63 -to 0 HBM21_AXI_awaddr_0
create_bd_port -dir I -from 5 -to 0 HBM21_AXI_awid_0
create_bd_port -dir I -from 7 -to 0 HBM21_AXI_awlen_0
create_bd_port -dir I -from 31 -to 0 HBM21_AXI_wstrb_0
create_bd_port -dir I -from 63 -to 0 HBM22_AXI_araddr_0
create_bd_port -dir I -from 5 -to 0 HBM22_AXI_arid_0
create_bd_port -dir I -from 7 -to 0 HBM22_AXI_arlen_0
create_bd_port -dir I -from 63 -to 0 HBM22_AXI_awaddr_0
create_bd_port -dir I -from 5 -to 0 HBM22_AXI_awid_0
create_bd_port -dir I -from 7 -to 0 HBM22_AXI_awlen_0
create_bd_port -dir I -from 31 -to 0 HBM22_AXI_wstrb_0
create_bd_port -dir I -from 63 -to 0 HBM23_AXI_araddr_0
create_bd_port -dir I -from 5 -to 0 HBM23_AXI_arid_0
create_bd_port -dir I -from 7 -to 0 HBM23_AXI_arlen_0
create_bd_port -dir I -from 63 -to 0 HBM23_AXI_awaddr_0
create_bd_port -dir I -from 5 -to 0 HBM23_AXI_awid_0
create_bd_port -dir I -from 7 -to 0 HBM23_AXI_awlen_0
create_bd_port -dir I -from 31 -to 0 HBM23_AXI_wstrb_0
create_bd_port -dir I -from 63 -to 0 HBM24_AXI_araddr_0
create_bd_port -dir I -from 5 -to 0 HBM24_AXI_arid_0
create_bd_port -dir I -from 7 -to 0 HBM24_AXI_arlen_0
create_bd_port -dir I -from 63 -to 0 HBM24_AXI_awaddr_0
create_bd_port -dir I -from 5 -to 0 HBM24_AXI_awid_0
create_bd_port -dir I -from 7 -to 0 HBM24_AXI_awlen_0
create_bd_port -dir I -from 31 -to 0 HBM24_AXI_wstrb_0
create_bd_port -dir I -from 63 -to 0 HBM25_AXI_araddr_0
create_bd_port -dir I -from 5 -to 0 HBM25_AXI_arid_0
create_bd_port -dir I -from 7 -to 0 HBM25_AXI_arlen_0
create_bd_port -dir I -from 63 -to 0 HBM25_AXI_awaddr_0
create_bd_port -dir I -from 5 -to 0 HBM25_AXI_awid_0
create_bd_port -dir I -from 7 -to 0 HBM25_AXI_awlen_0
create_bd_port -dir I -from 31 -to 0 HBM25_AXI_wstrb_0
create_bd_port -dir I -from 63 -to 0 HBM26_AXI_araddr_0
create_bd_port -dir I -from 5 -to 0 HBM26_AXI_arid_0
create_bd_port -dir I -from 7 -to 0 HBM26_AXI_arlen_0
create_bd_port -dir I -from 63 -to 0 HBM26_AXI_awaddr_0
create_bd_port -dir I -from 5 -to 0 HBM26_AXI_awid_0
create_bd_port -dir I -from 7 -to 0 HBM26_AXI_awlen_0
create_bd_port -dir I -from 31 -to 0 HBM26_AXI_wstrb_0
create_bd_port -dir I -from 63 -to 0 HBM27_AXI_araddr_0
create_bd_port -dir I -from 5 -to 0 HBM27_AXI_arid_0
create_bd_port -dir I -from 7 -to 0 HBM27_AXI_arlen_0
create_bd_port -dir I -from 63 -to 0 HBM27_AXI_awaddr_0
create_bd_port -dir I -from 5 -to 0 HBM27_AXI_awid_0
create_bd_port -dir I -from 7 -to 0 HBM27_AXI_awlen_0
create_bd_port -dir I -from 31 -to 0 HBM27_AXI_wstrb_0
create_bd_port -dir I -from 63 -to 0 HBM28_AXI_araddr_0
create_bd_port -dir I -from 5 -to 0 HBM28_AXI_arid_0
create_bd_port -dir I -from 7 -to 0 HBM28_AXI_arlen_0
create_bd_port -dir I -from 63 -to 0 HBM28_AXI_awaddr_0
create_bd_port -dir I -from 5 -to 0 HBM28_AXI_awid_0
create_bd_port -dir I -from 7 -to 0 HBM28_AXI_awlen_0
create_bd_port -dir I -from 31 -to 0 HBM28_AXI_wstrb_0
create_bd_port -dir I -from 63 -to 0 HBM29_AXI_araddr_0
create_bd_port -dir I -from 5 -to 0 HBM29_AXI_arid_0
create_bd_port -dir I -from 7 -to 0 HBM29_AXI_arlen_0
create_bd_port -dir I -from 63 -to 0 HBM29_AXI_awaddr_0
create_bd_port -dir I -from 5 -to 0 HBM29_AXI_awid_0
create_bd_port -dir I -from 7 -to 0 HBM29_AXI_awlen_0
create_bd_port -dir I -from 31 -to 0 HBM29_AXI_wstrb_0
create_bd_port -dir I -from 63 -to 0 HBM30_AXI_araddr_0
create_bd_port -dir I -from 5 -to 0 HBM30_AXI_arid_0
create_bd_port -dir I -from 7 -to 0 HBM30_AXI_arlen_0
create_bd_port -dir I -from 63 -to 0 HBM30_AXI_awaddr_0
create_bd_port -dir I -from 5 -to 0 HBM30_AXI_awid_0
create_bd_port -dir I -from 7 -to 0 HBM30_AXI_awlen_0
create_bd_port -dir I -from 31 -to 0 HBM30_AXI_wstrb_0
create_bd_port -dir I -from 63 -to 0 HBM31_AXI_araddr_0
create_bd_port -dir I -from 5 -to 0 HBM31_AXI_arid_0
create_bd_port -dir I -from 7 -to 0 HBM31_AXI_arlen_0
create_bd_port -dir I -from 63 -to 0 HBM31_AXI_awaddr_0
create_bd_port -dir I -from 5 -to 0 HBM31_AXI_awid_0
create_bd_port -dir I -from 7 -to 0 HBM31_AXI_awlen_0
create_bd_port -dir I -from 31 -to 0 HBM31_AXI_wstrb_0
create_bd_port -dir O -from 0 -to 0 HBM04_AXI_rvalid_0
create_bd_port -dir O -from 0 -to 0 HBM04_AXI_arready_0
create_bd_port -dir I -from 0 -to 0 HBM04_AXI_wlast_0
create_bd_port -dir O -from 0 -to 0 HBM04_AXI_wready_0
create_bd_port -dir I -from 2 -to 0 HBM04_AXI_arsize_0
create_bd_port -dir O -from 1 -to 0 HBM04_AXI_bresp_0
create_bd_port -dir I -from 0 -to 0 HBM04_AXI_wvalid_0
create_bd_port -dir I -from 1 -to 0 HBM04_AXI_awburst_0
create_bd_port -dir I -from 2 -to 0 HBM04_AXI_awsize_0
create_bd_port -dir I -from 1 -to 0 HBM04_AXI_arburst_0
create_bd_port -dir O -from 0 -to 0 HBM04_AXI_awready_0
create_bd_port -dir I -from 0 -to 0 HBM04_AXI_awvalid_0
create_bd_port -dir I -from 0 -to 0 HBM04_AXI_bready_0
create_bd_port -dir O -from 0 -to 0 HBM04_AXI_rlast_0
create_bd_port -dir O -from 0 -to 0 HBM04_AXI_bvalid_0
create_bd_port -dir I -from 0 -to 0 HBM04_AXI_arvalid_0
create_bd_port -dir I -from 0 -to 0 HBM04_AXI_rready_0
create_bd_port -dir I -from 2 -to 0 HBM05_AXI_awsize_0
create_bd_port -dir I -from 0 -to 0 HBM05_AXI_wlast_0
create_bd_port -dir O -from 0 -to 0 HBM05_AXI_rlast_0
create_bd_port -dir O -from 0 -to 0 HBM05_AXI_rvalid_0
create_bd_port -dir O -from 0 -to 0 HBM05_AXI_arready_0
create_bd_port -dir I -from 2 -to 0 HBM05_AXI_arsize_0
create_bd_port -dir I -from 0 -to 0 HBM05_AXI_arvalid_0
create_bd_port -dir O -from 1 -to 0 HBM05_AXI_bresp_0
create_bd_port -dir I -from 0 -to 0 HBM05_AXI_wvalid_0
create_bd_port -dir O -from 0 -to 0 HBM05_AXI_awready_0
create_bd_port -dir I -from 0 -to 0 HBM05_AXI_bready_0
create_bd_port -dir I -from 0 -to 0 HBM05_AXI_awvalid_0
create_bd_port -dir I -from 1 -to 0 HBM05_AXI_arburst_0
create_bd_port -dir O -from 0 -to 0 HBM05_AXI_bvalid_0
create_bd_port -dir O -from 0 -to 0 HBM05_AXI_wready_0
create_bd_port -dir I -from 1 -to 0 HBM05_AXI_awburst_0
create_bd_port -dir I -from 0 -to 0 HBM05_AXI_rready_0
create_bd_port -dir O -from 0 -to 0 HBM06_AXI_rvalid_0
create_bd_port -dir I -from 0 -to 0 HBM06_AXI_wvalid_0
create_bd_port -dir I -from 1 -to 0 HBM06_AXI_awburst_0
create_bd_port -dir I -from 2 -to 0 HBM06_AXI_awsize_0
create_bd_port -dir I -from 2 -to 0 HBM06_AXI_arsize_0
create_bd_port -dir I -from 0 -to 0 HBM06_AXI_arvalid_0
create_bd_port -dir I -from 1 -to 0 HBM06_AXI_arburst_0
create_bd_port -dir I -from 0 -to 0 HBM06_AXI_bready_0
create_bd_port -dir O -from 0 -to 0 HBM06_AXI_rlast_0
create_bd_port -dir O -from 0 -to 0 HBM06_AXI_arready_0
create_bd_port -dir O -from 0 -to 0 HBM06_AXI_bvalid_0
create_bd_port -dir O -from 0 -to 0 HBM06_AXI_wready_0
create_bd_port -dir O -from 0 -to 0 HBM06_AXI_awready_0
create_bd_port -dir O -from 1 -to 0 HBM06_AXI_bresp_0
create_bd_port -dir I -from 0 -to 0 HBM06_AXI_awvalid_0
create_bd_port -dir I -from 0 -to 0 HBM06_AXI_wlast_0
create_bd_port -dir I -from 0 -to 0 HBM06_AXI_rready_0
create_bd_port -dir I -from 1 -to 0 HBM07_AXI_awburst_0
create_bd_port -dir I -from 0 -to 0 HBM07_AXI_wlast_0
create_bd_port -dir O -from 0 -to 0 HBM07_AXI_arready_0
create_bd_port -dir O -from 0 -to 0 HBM07_AXI_awready_0
create_bd_port -dir O -from 0 -to 0 HBM07_AXI_rlast_0
create_bd_port -dir O -from 0 -to 0 HBM07_AXI_rvalid_0
create_bd_port -dir O -from 1 -to 0 HBM07_AXI_bresp_0
create_bd_port -dir O -from 0 -to 0 HBM07_AXI_bvalid_0
create_bd_port -dir O -from 0 -to 0 HBM07_AXI_wready_0
create_bd_port -dir I -from 1 -to 0 HBM07_AXI_arburst_0
create_bd_port -dir I -from 2 -to 0 HBM07_AXI_awsize_0
create_bd_port -dir I -from 0 -to 0 HBM07_AXI_awvalid_0
create_bd_port -dir I -from 0 -to 0 HBM07_AXI_arvalid_0
create_bd_port -dir I -from 0 -to 0 HBM07_AXI_bready_0
create_bd_port -dir I -from 0 -to 0 HBM07_AXI_wvalid_0
create_bd_port -dir I -from 2 -to 0 HBM07_AXI_arsize_0
create_bd_port -dir I -from 0 -to 0 HBM07_AXI_rready_0
create_bd_port -dir I -from 0 -to 0 HBM08_AXI_awvalid_0
create_bd_port -dir I -from 0 -to 0 HBM08_AXI_arvalid_0
create_bd_port -dir I -from 0 -to 0 HBM08_AXI_bready_0
create_bd_port -dir I -from 2 -to 0 HBM08_AXI_arsize_0
create_bd_port -dir I -from 1 -to 0 HBM08_AXI_awburst_0
create_bd_port -dir I -from 0 -to 0 HBM08_AXI_wlast_0
create_bd_port -dir I -from 0 -to 0 HBM08_AXI_wvalid_0
create_bd_port -dir O -from 0 -to 0 HBM08_AXI_awready_0
create_bd_port -dir O -from 0 -to 0 HBM08_AXI_rlast_0
create_bd_port -dir O -from 0 -to 0 HBM08_AXI_arready_0
create_bd_port -dir O -from 0 -to 0 HBM08_AXI_rvalid_0
create_bd_port -dir O -from 0 -to 0 HBM08_AXI_bvalid_0
create_bd_port -dir O -from 0 -to 0 HBM08_AXI_wready_0
create_bd_port -dir O -from 1 -to 0 HBM08_AXI_bresp_0
create_bd_port -dir I -from 1 -to 0 HBM08_AXI_arburst_0
create_bd_port -dir I -from 2 -to 0 HBM08_AXI_awsize_0
create_bd_port -dir I -from 0 -to 0 HBM08_AXI_rready_0
create_bd_port -dir O -from 0 -to 0 HBM09_AXI_rlast_0
create_bd_port -dir O -from 0 -to 0 HBM09_AXI_rvalid_0
create_bd_port -dir I -from 0 -to 0 HBM09_AXI_wlast_0
create_bd_port -dir O -from 0 -to 0 HBM09_AXI_arready_0
create_bd_port -dir I -from 1 -to 0 HBM09_AXI_awburst_0
create_bd_port -dir O -from 1 -to 0 HBM09_AXI_bresp_0
create_bd_port -dir O -from 0 -to 0 HBM09_AXI_bvalid_0
create_bd_port -dir I -from 1 -to 0 HBM09_AXI_arburst_0
create_bd_port -dir I -from 0 -to 0 HBM09_AXI_awvalid_0
create_bd_port -dir O -from 0 -to 0 HBM09_AXI_wready_0
create_bd_port -dir I -from 2 -to 0 HBM09_AXI_awsize_0
create_bd_port -dir I -from 2 -to 0 HBM09_AXI_arsize_0
create_bd_port -dir I -from 0 -to 0 HBM09_AXI_bready_0
create_bd_port -dir I -from 0 -to 0 HBM09_AXI_arvalid_0
create_bd_port -dir O -from 0 -to 0 HBM09_AXI_awready_0
create_bd_port -dir I -from 0 -to 0 HBM09_AXI_wvalid_0
create_bd_port -dir I -from 0 -to 0 HBM09_AXI_rready_0
create_bd_port -dir I -from 2 -to 0 HBM10_AXI_awsize_0
create_bd_port -dir I -from 2 -to 0 HBM10_AXI_arsize_0
create_bd_port -dir I -from 0 -to 0 HBM10_AXI_bready_0
create_bd_port -dir I -from 0 -to 0 HBM10_AXI_arvalid_0
create_bd_port -dir O -from 0 -to 0 HBM10_AXI_awready_0
create_bd_port -dir O -from 0 -to 0 HBM10_AXI_rvalid_0
create_bd_port -dir I -from 0 -to 0 HBM10_AXI_wlast_0
create_bd_port -dir I -from 0 -to 0 HBM10_AXI_wvalid_0
create_bd_port -dir O -from 0 -to 0 HBM10_AXI_rlast_0
create_bd_port -dir I -from 1 -to 0 HBM10_AXI_awburst_0
create_bd_port -dir I -from 1 -to 0 HBM10_AXI_arburst_0
create_bd_port -dir O -from 0 -to 0 HBM10_AXI_bvalid_0
create_bd_port -dir O -from 0 -to 0 HBM10_AXI_arready_0
create_bd_port -dir I -from 0 -to 0 HBM10_AXI_awvalid_0
create_bd_port -dir O -from 0 -to 0 HBM10_AXI_wready_0
create_bd_port -dir O -from 1 -to 0 HBM10_AXI_bresp_0
create_bd_port -dir I -from 0 -to 0 HBM10_AXI_rready_0
create_bd_port -dir I -from 1 -to 0 HBM11_AXI_arburst_0
create_bd_port -dir I -from 1 -to 0 HBM11_AXI_awburst_0
create_bd_port -dir O -from 0 -to 0 HBM11_AXI_arready_0
create_bd_port -dir I -from 0 -to 0 HBM11_AXI_awvalid_0
create_bd_port -dir O -from 1 -to 0 HBM11_AXI_bresp_0
create_bd_port -dir O -from 0 -to 0 HBM11_AXI_bvalid_0
create_bd_port -dir O -from 0 -to 0 HBM11_AXI_wready_0
create_bd_port -dir I -from 2 -to 0 HBM11_AXI_awsize_0
create_bd_port -dir I -from 2 -to 0 HBM11_AXI_arsize_0
create_bd_port -dir I -from 0 -to 0 HBM11_AXI_arvalid_0
create_bd_port -dir I -from 0 -to 0 HBM11_AXI_wlast_0
create_bd_port -dir O -from 0 -to 0 HBM11_AXI_awready_0
create_bd_port -dir I -from 0 -to 0 HBM11_AXI_bready_0
create_bd_port -dir I -from 0 -to 0 HBM11_AXI_wvalid_0
create_bd_port -dir O -from 0 -to 0 HBM11_AXI_rlast_0
create_bd_port -dir O -from 0 -to 0 HBM11_AXI_rvalid_0
create_bd_port -dir I -from 0 -to 0 HBM11_AXI_rready_0
create_bd_port -dir I -from 0 -to 0 HBM12_AXI_awvalid_0
create_bd_port -dir I -from 0 -to 0 HBM12_AXI_bready_0
create_bd_port -dir O -from 0 -to 0 HBM12_AXI_rlast_0
create_bd_port -dir O -from 0 -to 0 HBM12_AXI_bvalid_0
create_bd_port -dir I -from 0 -to 0 HBM12_AXI_arvalid_0
create_bd_port -dir O -from 0 -to 0 HBM12_AXI_rvalid_0
create_bd_port -dir O -from 0 -to 0 HBM12_AXI_arready_0
create_bd_port -dir I -from 0 -to 0 HBM12_AXI_wlast_0
create_bd_port -dir O -from 0 -to 0 HBM12_AXI_wready_0
create_bd_port -dir I -from 2 -to 0 HBM12_AXI_arsize_0
create_bd_port -dir O -from 1 -to 0 HBM12_AXI_bresp_0
create_bd_port -dir I -from 0 -to 0 HBM12_AXI_wvalid_0
create_bd_port -dir I -from 1 -to 0 HBM12_AXI_awburst_0
create_bd_port -dir I -from 2 -to 0 HBM12_AXI_awsize_0
create_bd_port -dir I -from 1 -to 0 HBM12_AXI_arburst_0
create_bd_port -dir O -from 0 -to 0 HBM12_AXI_awready_0
create_bd_port -dir I -from 0 -to 0 HBM12_AXI_rready_0
create_bd_port -dir I -from 0 -to 0 HBM13_AXI_bready_0
create_bd_port -dir I -from 0 -to 0 HBM13_AXI_awvalid_0
create_bd_port -dir I -from 1 -to 0 HBM13_AXI_arburst_0
create_bd_port -dir O -from 0 -to 0 HBM13_AXI_bvalid_0
create_bd_port -dir O -from 0 -to 0 HBM13_AXI_wready_0
create_bd_port -dir I -from 1 -to 0 HBM13_AXI_awburst_0
create_bd_port -dir I -from 2 -to 0 HBM13_AXI_awsize_0
create_bd_port -dir I -from 0 -to 0 HBM13_AXI_wlast_0
create_bd_port -dir O -from 0 -to 0 HBM13_AXI_rlast_0
create_bd_port -dir O -from 0 -to 0 HBM13_AXI_rvalid_0
create_bd_port -dir O -from 0 -to 0 HBM13_AXI_arready_0
create_bd_port -dir I -from 2 -to 0 HBM13_AXI_arsize_0
create_bd_port -dir I -from 0 -to 0 HBM13_AXI_arvalid_0
create_bd_port -dir O -from 1 -to 0 HBM13_AXI_bresp_0
create_bd_port -dir I -from 0 -to 0 HBM13_AXI_wvalid_0
create_bd_port -dir O -from 0 -to 0 HBM13_AXI_awready_0
create_bd_port -dir I -from 0 -to 0 HBM13_AXI_rready_0
create_bd_port -dir O -from 0 -to 0 HBM14_AXI_rvalid_0
create_bd_port -dir I -from 1 -to 0 HBM14_AXI_arburst_0
create_bd_port -dir O -from 0 -to 0 HBM14_AXI_awready_0
create_bd_port -dir I -from 0 -to 0 HBM14_AXI_bready_0
create_bd_port -dir I -from 0 -to 0 HBM14_AXI_awvalid_0
create_bd_port -dir O -from 0 -to 0 HBM14_AXI_bvalid_0
create_bd_port -dir O -from 0 -to 0 HBM14_AXI_wready_0
create_bd_port -dir I -from 0 -to 0 HBM14_AXI_arvalid_0
create_bd_port -dir O -from 1 -to 0 HBM14_AXI_bresp_0
create_bd_port -dir I -from 1 -to 0 HBM14_AXI_awburst_0
create_bd_port -dir O -from 0 -to 0 HBM14_AXI_rlast_0
create_bd_port -dir O -from 0 -to 0 HBM14_AXI_arready_0
create_bd_port -dir I -from 2 -to 0 HBM14_AXI_awsize_0
create_bd_port -dir I -from 0 -to 0 HBM14_AXI_wlast_0
create_bd_port -dir I -from 0 -to 0 HBM14_AXI_wvalid_0
create_bd_port -dir I -from 2 -to 0 HBM14_AXI_arsize_0
create_bd_port -dir I -from 0 -to 0 HBM14_AXI_rready_0
create_bd_port -dir I -from 0 -to 0 HBM15_AXI_bready_0
create_bd_port -dir O -from 0 -to 0 HBM15_AXI_bvalid_0
create_bd_port -dir I -from 0 -to 0 HBM15_AXI_arvalid_0
create_bd_port -dir I -from 0 -to 0 HBM15_AXI_wvalid_0
create_bd_port -dir O -from 0 -to 0 HBM15_AXI_awready_0
create_bd_port -dir I -from 0 -to 0 HBM15_AXI_awvalid_0
create_bd_port -dir O -from 0 -to 0 HBM15_AXI_wready_0
create_bd_port -dir I -from 1 -to 0 HBM15_AXI_arburst_0
create_bd_port -dir I -from 1 -to 0 HBM15_AXI_awburst_0
create_bd_port -dir I -from 2 -to 0 HBM15_AXI_awsize_0
create_bd_port -dir O -from 0 -to 0 HBM15_AXI_rlast_0
create_bd_port -dir O -from 0 -to 0 HBM15_AXI_arready_0
create_bd_port -dir O -from 0 -to 0 HBM15_AXI_rvalid_0
create_bd_port -dir I -from 0 -to 0 HBM15_AXI_wlast_0
create_bd_port -dir O -from 1 -to 0 HBM15_AXI_bresp_0
create_bd_port -dir I -from 2 -to 0 HBM15_AXI_arsize_0
create_bd_port -dir I -from 0 -to 0 HBM15_AXI_rready_0
create_bd_port -dir I -from 2 -to 0 HBM16_AXI_awsize_0
create_bd_port -dir I -from 0 -to 0 HBM16_AXI_wlast_0
create_bd_port -dir I -from 2 -to 0 HBM16_AXI_arsize_0
create_bd_port -dir I -from 0 -to 0 HBM16_AXI_bready_0
create_bd_port -dir I -from 0 -to 0 HBM16_AXI_wvalid_0
create_bd_port -dir O -from 0 -to 0 HBM16_AXI_rlast_0
create_bd_port -dir O -from 0 -to 0 HBM16_AXI_bvalid_0
create_bd_port -dir I -from 0 -to 0 HBM16_AXI_arvalid_0
create_bd_port -dir I -from 1 -to 0 HBM16_AXI_arburst_0
create_bd_port -dir O -from 0 -to 0 HBM16_AXI_awready_0
create_bd_port -dir I -from 0 -to 0 HBM16_AXI_awvalid_0
create_bd_port -dir O -from 0 -to 0 HBM16_AXI_arready_0
create_bd_port -dir O -from 0 -to 0 HBM16_AXI_wready_0
create_bd_port -dir O -from 1 -to 0 HBM16_AXI_bresp_0
create_bd_port -dir I -from 1 -to 0 HBM16_AXI_awburst_0
create_bd_port -dir O -from 0 -to 0 HBM16_AXI_rvalid_0
create_bd_port -dir I -from 0 -to 0 HBM16_AXI_rready_0
create_bd_port -dir O -from 0 -to 0 HBM17_AXI_rlast_0
create_bd_port -dir O -from 0 -to 0 HBM17_AXI_rvalid_0
create_bd_port -dir I -from 1 -to 0 HBM17_AXI_arburst_0
create_bd_port -dir O -from 0 -to 0 HBM17_AXI_arready_0
create_bd_port -dir I -from 0 -to 0 HBM17_AXI_wvalid_0
create_bd_port -dir I -from 2 -to 0 HBM17_AXI_arsize_0
create_bd_port -dir O -from 1 -to 0 HBM17_AXI_bresp_0
create_bd_port -dir O -from 0 -to 0 HBM17_AXI_wready_0
create_bd_port -dir I -from 0 -to 0 HBM17_AXI_bready_0
create_bd_port -dir I -from 1 -to 0 HBM17_AXI_awburst_0
create_bd_port -dir O -from 0 -to 0 HBM17_AXI_bvalid_0
create_bd_port -dir I -from 2 -to 0 HBM17_AXI_awsize_0
create_bd_port -dir I -from 0 -to 0 HBM17_AXI_wlast_0
create_bd_port -dir O -from 0 -to 0 HBM17_AXI_awready_0
create_bd_port -dir I -from 0 -to 0 HBM17_AXI_awvalid_0
create_bd_port -dir I -from 0 -to 0 HBM17_AXI_arvalid_0
create_bd_port -dir I -from 0 -to 0 HBM17_AXI_rready_0
create_bd_port -dir I -from 0 -to 0 HBM18_AXI_arvalid_0
create_bd_port -dir O -from 0 -to 0 HBM18_AXI_rvalid_0
create_bd_port -dir O -from 0 -to 0 HBM18_AXI_arready_0
create_bd_port -dir O -from 0 -to 0 HBM18_AXI_wready_0
create_bd_port -dir I -from 2 -to 0 HBM18_AXI_arsize_0
create_bd_port -dir O -from 1 -to 0 HBM18_AXI_bresp_0
create_bd_port -dir I -from 1 -to 0 HBM18_AXI_awburst_0
create_bd_port -dir I -from 2 -to 0 HBM18_AXI_awsize_0
create_bd_port -dir I -from 0 -to 0 HBM18_AXI_wlast_0
create_bd_port -dir I -from 1 -to 0 HBM18_AXI_arburst_0
create_bd_port -dir O -from 0 -to 0 HBM18_AXI_awready_0
create_bd_port -dir I -from 0 -to 0 HBM18_AXI_bready_0
create_bd_port -dir I -from 0 -to 0 HBM18_AXI_wvalid_0
create_bd_port -dir I -from 0 -to 0 HBM18_AXI_awvalid_0
create_bd_port -dir O -from 0 -to 0 HBM18_AXI_rlast_0
create_bd_port -dir O -from 0 -to 0 HBM18_AXI_bvalid_0
create_bd_port -dir I -from 0 -to 0 HBM18_AXI_rready_0
create_bd_port -dir O -from 0 -to 0 HBM19_AXI_rvalid_0
create_bd_port -dir I -from 0 -to 0 HBM19_AXI_wlast_0
create_bd_port -dir O -from 0 -to 0 HBM19_AXI_wready_0
create_bd_port -dir I -from 2 -to 0 HBM19_AXI_arsize_0
create_bd_port -dir I -from 1 -to 0 HBM19_AXI_awburst_0
create_bd_port -dir I -from 2 -to 0 HBM19_AXI_awsize_0
create_bd_port -dir O -from 0 -to 0 HBM19_AXI_arready_0
create_bd_port -dir O -from 0 -to 0 HBM19_AXI_awready_0
create_bd_port -dir I -from 0 -to 0 HBM19_AXI_awvalid_0
create_bd_port -dir O -from 1 -to 0 HBM19_AXI_bresp_0
create_bd_port -dir I -from 0 -to 0 HBM19_AXI_bready_0
create_bd_port -dir I -from 1 -to 0 HBM19_AXI_arburst_0
create_bd_port -dir O -from 0 -to 0 HBM19_AXI_bvalid_0
create_bd_port -dir I -from 0 -to 0 HBM19_AXI_arvalid_0
create_bd_port -dir I -from 0 -to 0 HBM19_AXI_wvalid_0
create_bd_port -dir O -from 0 -to 0 HBM19_AXI_rlast_0
create_bd_port -dir I -from 0 -to 0 HBM19_AXI_rready_0
create_bd_port -dir O -from 0 -to 0 HBM20_AXI_rvalid_0
create_bd_port -dir O -from 0 -to 0 HBM20_AXI_arready_0
create_bd_port -dir I -from 0 -to 0 HBM20_AXI_wlast_0
create_bd_port -dir O -from 0 -to 0 HBM20_AXI_wready_0
create_bd_port -dir I -from 2 -to 0 HBM20_AXI_arsize_0
create_bd_port -dir O -from 1 -to 0 HBM20_AXI_bresp_0
create_bd_port -dir I -from 0 -to 0 HBM20_AXI_wvalid_0
create_bd_port -dir I -from 1 -to 0 HBM20_AXI_arburst_0
create_bd_port -dir O -from 0 -to 0 HBM20_AXI_awready_0
create_bd_port -dir I -from 1 -to 0 HBM20_AXI_awburst_0
create_bd_port -dir I -from 2 -to 0 HBM20_AXI_awsize_0
create_bd_port -dir I -from 0 -to 0 HBM20_AXI_awvalid_0
create_bd_port -dir I -from 0 -to 0 HBM20_AXI_bready_0
create_bd_port -dir O -from 0 -to 0 HBM20_AXI_rlast_0
create_bd_port -dir O -from 0 -to 0 HBM20_AXI_bvalid_0
create_bd_port -dir I -from 0 -to 0 HBM20_AXI_arvalid_0
create_bd_port -dir I -from 0 -to 0 HBM20_AXI_rready_0
create_bd_port -dir O -from 0 -to 0 HBM21_AXI_rvalid_0
create_bd_port -dir O -from 0 -to 0 HBM21_AXI_arready_0
create_bd_port -dir I -from 2 -to 0 HBM21_AXI_arsize_0
create_bd_port -dir I -from 0 -to 0 HBM21_AXI_arvalid_0
create_bd_port -dir O -from 1 -to 0 HBM21_AXI_bresp_0
create_bd_port -dir I -from 0 -to 0 HBM21_AXI_wvalid_0
create_bd_port -dir O -from 0 -to 0 HBM21_AXI_awready_0
create_bd_port -dir I -from 0 -to 0 HBM21_AXI_bready_0
create_bd_port -dir I -from 0 -to 0 HBM21_AXI_awvalid_0
create_bd_port -dir I -from 1 -to 0 HBM21_AXI_arburst_0
create_bd_port -dir O -from 0 -to 0 HBM21_AXI_bvalid_0
create_bd_port -dir O -from 0 -to 0 HBM21_AXI_wready_0
create_bd_port -dir I -from 1 -to 0 HBM21_AXI_awburst_0
create_bd_port -dir I -from 2 -to 0 HBM21_AXI_awsize_0
create_bd_port -dir I -from 0 -to 0 HBM21_AXI_wlast_0
create_bd_port -dir O -from 0 -to 0 HBM21_AXI_rlast_0
create_bd_port -dir I -from 0 -to 0 HBM21_AXI_rready_0
create_bd_port -dir O -from 1 -to 0 HBM22_AXI_bresp_0
create_bd_port -dir I -from 1 -to 0 HBM22_AXI_awburst_0
create_bd_port -dir I -from 2 -to 0 HBM22_AXI_awsize_0
create_bd_port -dir I -from 0 -to 0 HBM22_AXI_wlast_0
create_bd_port -dir O -from 0 -to 0 HBM22_AXI_rvalid_0
create_bd_port -dir I -from 0 -to 0 HBM22_AXI_wvalid_0
create_bd_port -dir I -from 2 -to 0 HBM22_AXI_arsize_0
create_bd_port -dir I -from 0 -to 0 HBM22_AXI_arvalid_0
create_bd_port -dir I -from 1 -to 0 HBM22_AXI_arburst_0
create_bd_port -dir O -from 0 -to 0 HBM22_AXI_awready_0
create_bd_port -dir I -from 0 -to 0 HBM22_AXI_bready_0
create_bd_port -dir I -from 0 -to 0 HBM22_AXI_awvalid_0
create_bd_port -dir O -from 0 -to 0 HBM22_AXI_rlast_0
create_bd_port -dir O -from 0 -to 0 HBM22_AXI_arready_0
create_bd_port -dir O -from 0 -to 0 HBM22_AXI_bvalid_0
create_bd_port -dir O -from 0 -to 0 HBM22_AXI_wready_0
create_bd_port -dir I -from 0 -to 0 HBM22_AXI_rready_0
create_bd_port -dir O -from 0 -to 0 HBM23_AXI_bvalid_0
create_bd_port -dir I -from 0 -to 0 HBM23_AXI_arvalid_0
create_bd_port -dir I -from 0 -to 0 HBM23_AXI_wvalid_0
create_bd_port -dir O -from 0 -to 0 HBM23_AXI_awready_0
create_bd_port -dir I -from 0 -to 0 HBM23_AXI_awvalid_0
create_bd_port -dir O -from 0 -to 0 HBM23_AXI_wready_0
create_bd_port -dir I -from 1 -to 0 HBM23_AXI_arburst_0
create_bd_port -dir I -from 1 -to 0 HBM23_AXI_awburst_0
create_bd_port -dir I -from 2 -to 0 HBM23_AXI_awsize_0
create_bd_port -dir O -from 0 -to 0 HBM23_AXI_rlast_0
create_bd_port -dir O -from 0 -to 0 HBM23_AXI_arready_0
create_bd_port -dir O -from 0 -to 0 HBM23_AXI_rvalid_0
create_bd_port -dir I -from 0 -to 0 HBM23_AXI_wlast_0
create_bd_port -dir O -from 1 -to 0 HBM23_AXI_bresp_0
create_bd_port -dir I -from 2 -to 0 HBM23_AXI_arsize_0
create_bd_port -dir I -from 0 -to 0 HBM23_AXI_bready_0
create_bd_port -dir I -from 0 -to 0 HBM23_AXI_rready_0
create_bd_port -dir I -from 2 -to 0 HBM24_AXI_arsize_0
create_bd_port -dir I -from 0 -to 0 HBM24_AXI_bready_0
create_bd_port -dir I -from 0 -to 0 HBM24_AXI_wvalid_0
create_bd_port -dir O -from 0 -to 0 HBM24_AXI_rlast_0
create_bd_port -dir O -from 0 -to 0 HBM24_AXI_bvalid_0
create_bd_port -dir I -from 0 -to 0 HBM24_AXI_arvalid_0
create_bd_port -dir I -from 1 -to 0 HBM24_AXI_arburst_0
create_bd_port -dir O -from 0 -to 0 HBM24_AXI_awready_0
create_bd_port -dir I -from 0 -to 0 HBM24_AXI_awvalid_0
create_bd_port -dir O -from 0 -to 0 HBM24_AXI_arready_0
create_bd_port -dir O -from 0 -to 0 HBM24_AXI_wready_0
create_bd_port -dir O -from 1 -to 0 HBM24_AXI_bresp_0
create_bd_port -dir I -from 1 -to 0 HBM24_AXI_awburst_0
create_bd_port -dir I -from 2 -to 0 HBM24_AXI_awsize_0
create_bd_port -dir O -from 0 -to 0 HBM24_AXI_rvalid_0
create_bd_port -dir I -from 0 -to 0 HBM24_AXI_wlast_0
create_bd_port -dir I -from 0 -to 0 HBM24_AXI_rready_0
create_bd_port -dir I -from 0 -to 0 HBM25_AXI_arvalid_0
create_bd_port -dir I -from 0 -to 0 HBM25_AXI_wvalid_0
create_bd_port -dir I -from 1 -to 0 HBM25_AXI_arburst_0
create_bd_port -dir O -from 0 -to 0 HBM25_AXI_wready_0
create_bd_port -dir I -from 2 -to 0 HBM25_AXI_arsize_0
create_bd_port -dir O -from 0 -to 0 HBM25_AXI_rlast_0
create_bd_port -dir I -from 1 -to 0 HBM25_AXI_awburst_0
create_bd_port -dir O -from 0 -to 0 HBM25_AXI_rvalid_0
create_bd_port -dir I -from 2 -to 0 HBM25_AXI_awsize_0
create_bd_port -dir I -from 0 -to 0 HBM25_AXI_wlast_0
create_bd_port -dir O -from 1 -to 0 HBM25_AXI_bresp_0
create_bd_port -dir O -from 0 -to 0 HBM25_AXI_awready_0
create_bd_port -dir O -from 0 -to 0 HBM25_AXI_arready_0
create_bd_port -dir I -from 0 -to 0 HBM25_AXI_bready_0
create_bd_port -dir I -from 0 -to 0 HBM25_AXI_awvalid_0
create_bd_port -dir O -from 0 -to 0 HBM25_AXI_bvalid_0
create_bd_port -dir I -from 0 -to 0 HBM25_AXI_rready_0
create_bd_port -dir I -from 2 -to 0 HBM26_AXI_arsize_0
create_bd_port -dir O -from 1 -to 0 HBM26_AXI_bresp_0
create_bd_port -dir I -from 1 -to 0 HBM26_AXI_awburst_0
create_bd_port -dir I -from 2 -to 0 HBM26_AXI_awsize_0
create_bd_port -dir I -from 0 -to 0 HBM26_AXI_wlast_0
create_bd_port -dir I -from 1 -to 0 HBM26_AXI_arburst_0
create_bd_port -dir O -from 0 -to 0 HBM26_AXI_awready_0
create_bd_port -dir I -from 0 -to 0 HBM26_AXI_bready_0
create_bd_port -dir I -from 0 -to 0 HBM26_AXI_wvalid_0
create_bd_port -dir I -from 0 -to 0 HBM26_AXI_awvalid_0
create_bd_port -dir O -from 0 -to 0 HBM26_AXI_rlast_0
create_bd_port -dir O -from 0 -to 0 HBM26_AXI_bvalid_0
create_bd_port -dir I -from 0 -to 0 HBM26_AXI_arvalid_0
create_bd_port -dir O -from 0 -to 0 HBM26_AXI_rvalid_0
create_bd_port -dir O -from 0 -to 0 HBM26_AXI_arready_0
create_bd_port -dir O -from 0 -to 0 HBM26_AXI_wready_0
create_bd_port -dir I -from 0 -to 0 HBM26_AXI_rready_0
create_bd_port -dir O -from 0 -to 0 HBM27_AXI_arready_0
create_bd_port -dir O -from 0 -to 0 HBM27_AXI_awready_0
create_bd_port -dir I -from 0 -to 0 HBM27_AXI_awvalid_0
create_bd_port -dir O -from 1 -to 0 HBM27_AXI_bresp_0
create_bd_port -dir I -from 0 -to 0 HBM27_AXI_bready_0
create_bd_port -dir I -from 1 -to 0 HBM27_AXI_arburst_0
create_bd_port -dir O -from 0 -to 0 HBM27_AXI_bvalid_0
create_bd_port -dir I -from 0 -to 0 HBM27_AXI_arvalid_0
create_bd_port -dir I -from 0 -to 0 HBM27_AXI_wvalid_0
create_bd_port -dir O -from 0 -to 0 HBM27_AXI_rlast_0
create_bd_port -dir O -from 0 -to 0 HBM27_AXI_rvalid_0
create_bd_port -dir I -from 0 -to 0 HBM27_AXI_wlast_0
create_bd_port -dir O -from 0 -to 0 HBM27_AXI_wready_0
create_bd_port -dir I -from 2 -to 0 HBM27_AXI_arsize_0
create_bd_port -dir I -from 1 -to 0 HBM27_AXI_awburst_0
create_bd_port -dir I -from 2 -to 0 HBM27_AXI_awsize_0
create_bd_port -dir I -from 0 -to 0 HBM27_AXI_rready_0
create_bd_port -dir O -from 1 -to 0 HBM28_AXI_bresp_0
create_bd_port -dir I -from 0 -to 0 HBM28_AXI_wvalid_0
create_bd_port -dir I -from 1 -to 0 HBM28_AXI_awburst_0
create_bd_port -dir I -from 2 -to 0 HBM28_AXI_awsize_0
create_bd_port -dir O -from 0 -to 0 HBM28_AXI_awready_0
create_bd_port -dir O -from 0 -to 0 HBM28_AXI_rlast_0
create_bd_port -dir I -from 0 -to 0 HBM28_AXI_awvalid_0
create_bd_port -dir I -from 0 -to 0 HBM28_AXI_arvalid_0
create_bd_port -dir O -from 0 -to 0 HBM28_AXI_rvalid_0
create_bd_port -dir O -from 0 -to 0 HBM28_AXI_arready_0
create_bd_port -dir I -from 0 -to 0 HBM28_AXI_bready_0
create_bd_port -dir O -from 0 -to 0 HBM28_AXI_bvalid_0
create_bd_port -dir I -from 2 -to 0 HBM28_AXI_arsize_0
create_bd_port -dir I -from 1 -to 0 HBM28_AXI_arburst_0
create_bd_port -dir I -from 0 -to 0 HBM28_AXI_wlast_0
create_bd_port -dir O -from 0 -to 0 HBM28_AXI_wready_0
create_bd_port -dir I -from 0 -to 0 HBM28_AXI_rready_0
create_bd_port -dir I -from 1 -to 0 HBM29_AXI_arburst_0
create_bd_port -dir O -from 0 -to 0 HBM29_AXI_bvalid_0
create_bd_port -dir O -from 0 -to 0 HBM29_AXI_wready_0
create_bd_port -dir I -from 1 -to 0 HBM29_AXI_awburst_0
create_bd_port -dir I -from 2 -to 0 HBM29_AXI_awsize_0
create_bd_port -dir I -from 0 -to 0 HBM29_AXI_wlast_0
create_bd_port -dir O -from 0 -to 0 HBM29_AXI_rlast_0
create_bd_port -dir O -from 0 -to 0 HBM29_AXI_rvalid_0
create_bd_port -dir O -from 0 -to 0 HBM29_AXI_arready_0
create_bd_port -dir I -from 2 -to 0 HBM29_AXI_arsize_0
create_bd_port -dir I -from 0 -to 0 HBM29_AXI_arvalid_0
create_bd_port -dir O -from 1 -to 0 HBM29_AXI_bresp_0
create_bd_port -dir I -from 0 -to 0 HBM29_AXI_wvalid_0
create_bd_port -dir O -from 0 -to 0 HBM29_AXI_awready_0
create_bd_port -dir I -from 0 -to 0 HBM29_AXI_bready_0
create_bd_port -dir I -from 0 -to 0 HBM29_AXI_awvalid_0
create_bd_port -dir I -from 0 -to 0 HBM29_AXI_rready_0
create_bd_port -dir I -from 1 -to 0 HBM30_AXI_arburst_0
create_bd_port -dir O -from 0 -to 0 HBM30_AXI_awready_0
create_bd_port -dir I -from 0 -to 0 HBM30_AXI_bready_0
create_bd_port -dir I -from 0 -to 0 HBM30_AXI_awvalid_0
create_bd_port -dir O -from 0 -to 0 HBM30_AXI_rlast_0
create_bd_port -dir O -from 0 -to 0 HBM30_AXI_arready_0
create_bd_port -dir O -from 0 -to 0 HBM30_AXI_bvalid_0
create_bd_port -dir O -from 0 -to 0 HBM30_AXI_wready_0
create_bd_port -dir O -from 1 -to 0 HBM30_AXI_bresp_0
create_bd_port -dir I -from 1 -to 0 HBM30_AXI_awburst_0
create_bd_port -dir I -from 2 -to 0 HBM30_AXI_awsize_0
create_bd_port -dir I -from 0 -to 0 HBM30_AXI_wlast_0
